# Altium project cSLIM-shield.PrjPcb (part 1 of 2)
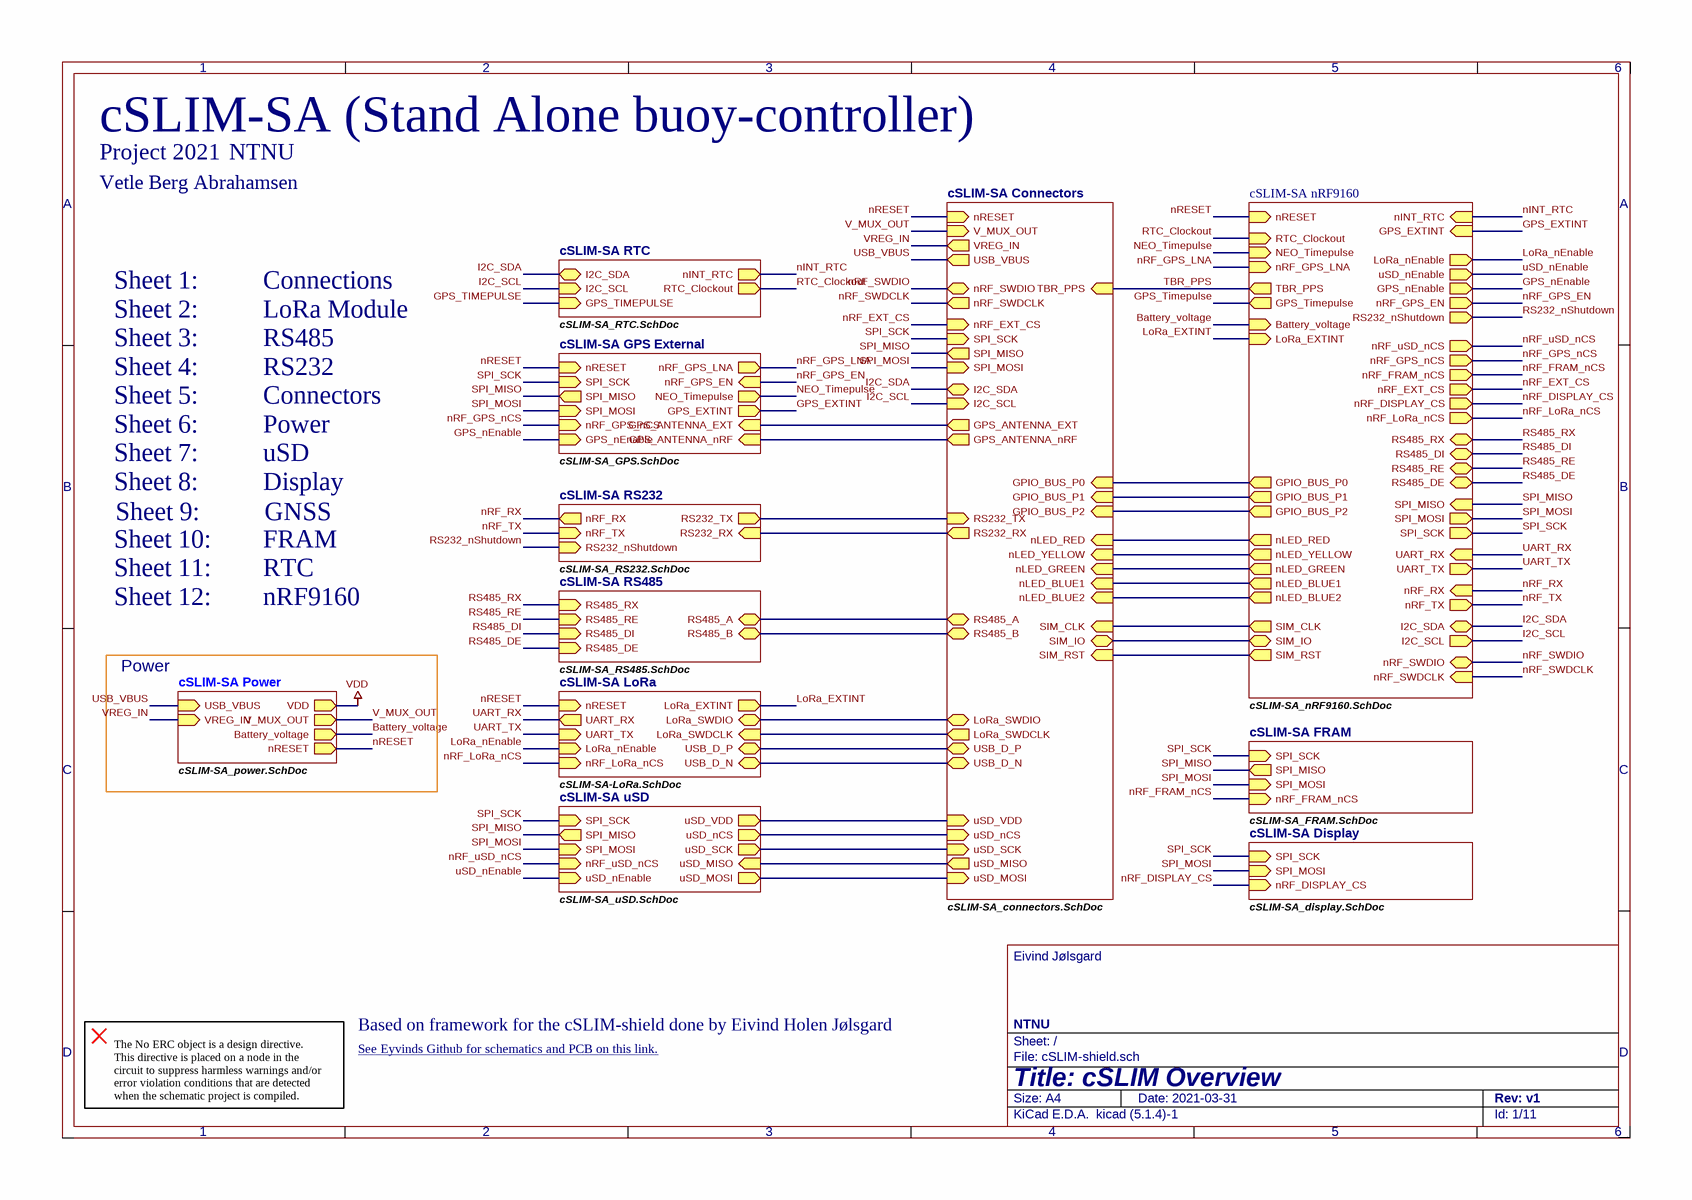
[diagram p0: cSLIM-SA.SchDoc]
12 sheets, 197 parts. Net scope: hierarchical (ports join the sheet entries above them; power ports are global).
Board files: cSLIM_V1.PcbDoc, cSLIM-shield.PcbDoc
Sheets:
  cSLIM-SA.SchDoc
    cSLIM-SA LoRa = cSLIM-SA-LoRa.SchDoc
    cSLIM-SA RS485 = cSLIM-SA_RS485.SchDoc
    cSLIM-SA RS232 = cSLIM-SA_RS232.SchDoc
    cSLIM-SA Connectors = cSLIM-SA_connectors.SchDoc
    cSLIM-SA Power = cSLIM-SA_power.SchDoc
    cSLIM-SA uSD = cSLIM-SA_uSD.SchDoc
    cSLIM-SA Display = cSLIM-SA_display.SchDoc
    cSLIM-SA GPS External = cSLIM-SA_GPS.SchDoc
    cSLIM-SA FRAM = cSLIM-SA_FRAM.SchDoc
    cSLIM-SA RTC = cSLIM-SA_RTC.SchDoc
    cSLIM-SA nRF9160 = cSLIM-SA_nRF9160.SchDoc

## Sheet cSLIM-SA.SchDoc
size 297 x 210 mm; SheetNumber: 1; SheetTotal: 12

### Sub-sheets
cSLIM-SA Connectors = cSLIM-SA_connectors.SchDoc: RS485_A (bidir), RS485_B (bidir), TBR_PPS (in), V_MUX_OUT (in), RS232_TX (in), RS232_RX (out), LoRa_SWDIO (bidir), LoRa_SWDCLK (out), nRESET (in), USB_D_N (bidir), USB_D_P (bidir), USB_VBUS (out), uSD_nCS (in), uSD_MOSI (in), uSD_SCK (in), uSD_MISO (out), uSD_VDD (in), nRF_EXT_CS (in), SPI_SCK (in), SPI_MOSI (in), SPI_MISO (out), I2C_SCL (in), I2C_SDA (bidir), nLED_RED (in), nLED_YELLOW (in), nLED_GREEN (in), nLED_BLUE1 (in), GPS_ANTENNA_EXT (out), nLED_BLUE2 (in), nRF_SWDIO (bidir), nRF_SWDCLK (out), SIM_CLK (in), SIM_RST (in), SIM_IO (bidir), GPS_ANTENNA_nRF (out), VREG_IN (out), GPIO_BUS_P0 (in), GPIO_BUS_P1 (in), GPIO_BUS_P2 (in)
cSLIM-SA Display = cSLIM-SA_display.SchDoc: SPI_SCK (in), SPI_MOSI (in), nRF_DISPLAY_CS (in)
cSLIM-SA FRAM = cSLIM-SA_FRAM.SchDoc: SPI_MISO (out), nRF_FRAM_nCS (in), SPI_SCK (in), SPI_MOSI (in)
cSLIM-SA GPS External = cSLIM-SA_GPS.SchDoc: nRF_GPS_nCS (in), GPS_nEnable (in), SPI_MISO (out), SPI_MOSI (in), SPI_SCK (in), NEO_Timepulse (out), GPS_EXTINT (out), nRESET (in), GPS_ANTENNA_EXT (in), nRF_GPS_EN (in), GPS_ANTENNA_nRF (in), nRF_GPS_LNA (out)
cSLIM-SA LoRa = cSLIM-SA-LoRa.SchDoc: UART_RX (out), UART_TX (in), USB_D_P (bidir), USB_D_N (bidir), LoRa_SWDIO (bidir), LoRa_SWDCLK (in), nRESET (in), LoRa_nEnable (in), LoRa_EXTINT (out), nRF_LoRa_nCS (in)
cSLIM-SA nRF9160 = cSLIM-SA_nRF9160.SchDoc: nRESET (in), RS485_RX (bidir), RS485_DI (bidir), nLED_RED (out), nINT_RTC (in), nLED_GREEN (out), LoRa_nEnable (out), uSD_nEnable (out), nRF_uSD_nCS (out), UART_RX (in), UART_TX (out), nRF_GPS_nCS (out), RS232_nShutdown (out), GPS_nEnable (out), Battery_voltage (in), nRF_EXT_CS (out), I2C_SDA (bidir), I2C_SCL (out), RS485_RE (bidir), RS485_DE (bidir), TBR_PPS (out), SPI_MISO (in), SPI_MOSI (out), SPI_SCK (out), LoRa_EXTINT (in), nRF_RX (in), nRF_TX (out), nRF_FRAM_nCS (out), RTC_Clockout (in), GPS_Timepulse (out), nRF_SWDIO (bidir), nRF_SWDCLK (in), SIM_CLK (out), SIM_IO (bidir), SIM_RST (out), nRF_DISPLAY_CS (out), nLED_YELLOW (out), nLED_BLUE1 (out), nLED_BLUE2 (out), GPS_EXTINT (in), nRF_GPS_EN (out), nRF_GPS_LNA (in), NEO_Timepulse (in), GPIO_BUS_P0 (out), GPIO_BUS_P2 (out), GPIO_BUS_P1 (out), nRF_LoRa_nCS (out)
cSLIM-SA Power = cSLIM-SA_power.SchDoc: nRESET (out), VDD (out), USB_VBUS (in), V_MUX_OUT (out), Battery_voltage (out), VREG_IN (in)
cSLIM-SA RS232 = cSLIM-SA_RS232.SchDoc: RS232_nShutdown (in), RS232_TX (out), RS232_RX (in), nRF_TX (in), nRF_RX (out)
cSLIM-SA RS485 = cSLIM-SA_RS485.SchDoc: RS485_RX (in), RS485_RE (in), RS485_DE (in), RS485_DI (in), RS485_B (bidir), RS485_A (bidir)
cSLIM-SA RTC = cSLIM-SA_RTC.SchDoc: I2C_SCL (in), I2C_SDA (bidir), nINT_RTC (out), RTC_Clockout (out), GPS_TIMEPULSE (in)
cSLIM-SA uSD = cSLIM-SA_uSD.SchDoc: uSD_VDD (out), uSD_MISO (in), uSD_MOSI (out), uSD_SCK (out), uSD_nCS (out), nRF_uSD_nCS (in), uSD_nEnable (in), SPI_MISO (out), SPI_MOSI (in), SPI_SCK (in)

### Nets
Battery_voltage: sheet cSLIM-SA Power/Battery_voltage, sheet cSLIM-SA nRF9160/Battery_voltage
GPIO_BUS_P0: sheet cSLIM-SA Connectors/GPIO_BUS_P0, sheet cSLIM-SA nRF9160/GPIO_BUS_P0
GPIO_BUS_P1: sheet cSLIM-SA Connectors/GPIO_BUS_P1, sheet cSLIM-SA nRF9160/GPIO_BUS_P1
GPIO_BUS_P2: sheet cSLIM-SA Connectors/GPIO_BUS_P2, sheet cSLIM-SA nRF9160/GPIO_BUS_P2
GPS_ANTENNA_EXT: sheet cSLIM-SA Connectors/GPS_ANTENNA_EXT, sheet cSLIM-SA GPS External/GPS_ANTENNA_EXT
GPS_ANTENNA_nRF: sheet cSLIM-SA Connectors/GPS_ANTENNA_nRF, sheet cSLIM-SA GPS External/GPS_ANTENNA_nRF
GPS_EXTINT: sheet cSLIM-SA GPS External/GPS_EXTINT, sheet cSLIM-SA nRF9160/GPS_EXTINT
GPS_nEnable: sheet cSLIM-SA GPS External/GPS_nEnable, sheet cSLIM-SA nRF9160/GPS_nEnable
GPS_TIMEPULSE: sheet cSLIM-SA RTC/GPS_TIMEPULSE, sheet cSLIM-SA nRF9160/GPS_Timepulse
I2C_SCL: sheet cSLIM-SA Connectors/I2C_SCL, sheet cSLIM-SA RTC/I2C_SCL, sheet cSLIM-SA nRF9160/I2C_SCL
I2C_SDA: sheet cSLIM-SA Connectors/I2C_SDA, sheet cSLIM-SA RTC/I2C_SDA, sheet cSLIM-SA nRF9160/I2C_SDA
LoRa_EXTINT: sheet cSLIM-SA LoRa/LoRa_EXTINT, sheet cSLIM-SA nRF9160/LoRa_EXTINT
LoRa_nEnable: sheet cSLIM-SA LoRa/LoRa_nEnable, sheet cSLIM-SA nRF9160/LoRa_nEnable
LoRa_SWDCLK: sheet cSLIM-SA LoRa/LoRa_SWDCLK, sheet cSLIM-SA Connectors/LoRa_SWDCLK
LoRa_SWDIO: sheet cSLIM-SA LoRa/LoRa_SWDIO, sheet cSLIM-SA Connectors/LoRa_SWDIO
NEO_Timepulse: sheet cSLIM-SA GPS External/NEO_Timepulse, sheet cSLIM-SA nRF9160/NEO_Timepulse
nINT_RTC: sheet cSLIM-SA RTC/nINT_RTC, sheet cSLIM-SA nRF9160/nINT_RTC
nLED_BLUE1: sheet cSLIM-SA Connectors/nLED_BLUE1, sheet cSLIM-SA nRF9160/nLED_BLUE1
nLED_BLUE2: sheet cSLIM-SA Connectors/nLED_BLUE2, sheet cSLIM-SA nRF9160/nLED_BLUE2
nLED_GREEN: sheet cSLIM-SA Connectors/nLED_GREEN, sheet cSLIM-SA nRF9160/nLED_GREEN
nLED_RED: sheet cSLIM-SA Connectors/nLED_RED, sheet cSLIM-SA nRF9160/nLED_RED
nLED_YELLOW: sheet cSLIM-SA Connectors/nLED_YELLOW, sheet cSLIM-SA nRF9160/nLED_YELLOW
nRESET: sheet cSLIM-SA LoRa/nRESET, sheet cSLIM-SA Connectors/nRESET, sheet cSLIM-SA Power/nRESET, sheet cSLIM-SA GPS External/nRESET, sheet cSLIM-SA nRF9160/nRESET
nRF_DISPLAY_CS: sheet cSLIM-SA Display/nRF_DISPLAY_CS, sheet cSLIM-SA nRF9160/nRF_DISPLAY_CS
nRF_EXT_CS: sheet cSLIM-SA Connectors/nRF_EXT_CS, sheet cSLIM-SA nRF9160/nRF_EXT_CS
nRF_FRAM_nCS: sheet cSLIM-SA FRAM/nRF_FRAM_nCS, sheet cSLIM-SA nRF9160/nRF_FRAM_nCS
nRF_GPS_EN: sheet cSLIM-SA GPS External/nRF_GPS_EN, sheet cSLIM-SA nRF9160/nRF_GPS_EN
nRF_GPS_LNA: sheet cSLIM-SA GPS External/nRF_GPS_LNA, sheet cSLIM-SA nRF9160/nRF_GPS_LNA
nRF_GPS_nCS: sheet cSLIM-SA GPS External/nRF_GPS_nCS, sheet cSLIM-SA nRF9160/nRF_GPS_nCS
nRF_LoRa_nCS: sheet cSLIM-SA LoRa/nRF_LoRa_nCS, sheet cSLIM-SA nRF9160/nRF_LoRa_nCS
nRF_RX: sheet cSLIM-SA RS232/nRF_RX, sheet cSLIM-SA nRF9160/nRF_RX
nRF_SWDCLK: sheet cSLIM-SA Connectors/nRF_SWDCLK, sheet cSLIM-SA nRF9160/nRF_SWDCLK
nRF_SWDIO: sheet cSLIM-SA Connectors/nRF_SWDIO, sheet cSLIM-SA nRF9160/nRF_SWDIO
nRF_TX: sheet cSLIM-SA RS232/nRF_TX, sheet cSLIM-SA nRF9160/nRF_TX
nRF_uSD_nCS: sheet cSLIM-SA uSD/nRF_uSD_nCS, sheet cSLIM-SA nRF9160/nRF_uSD_nCS
RS232_nShutdown: sheet cSLIM-SA RS232/RS232_nShutdown, sheet cSLIM-SA nRF9160/RS232_nShutdown
RS232_RX: sheet cSLIM-SA RS232/RS232_RX, sheet cSLIM-SA Connectors/RS232_RX
RS232_TX: sheet cSLIM-SA RS232/RS232_TX, sheet cSLIM-SA Connectors/RS232_TX
RS485_A: sheet cSLIM-SA RS485/RS485_A, sheet cSLIM-SA Connectors/RS485_A
RS485_B: sheet cSLIM-SA RS485/RS485_B, sheet cSLIM-SA Connectors/RS485_B
RS485_DE: sheet cSLIM-SA RS485/RS485_DE, sheet cSLIM-SA nRF9160/RS485_DE
RS485_DI: sheet cSLIM-SA RS485/RS485_DI, sheet cSLIM-SA nRF9160/RS485_DI
RS485_RE: sheet cSLIM-SA RS485/RS485_RE, sheet cSLIM-SA nRF9160/RS485_RE
RS485_RX: sheet cSLIM-SA RS485/RS485_RX, sheet cSLIM-SA nRF9160/RS485_RX
RTC_Clockout: sheet cSLIM-SA RTC/RTC_Clockout, sheet cSLIM-SA nRF9160/RTC_Clockout
SIM_CLK: sheet cSLIM-SA Connectors/SIM_CLK, sheet cSLIM-SA nRF9160/SIM_CLK
SIM_IO: sheet cSLIM-SA Connectors/SIM_IO, sheet cSLIM-SA nRF9160/SIM_IO
SIM_RST: sheet cSLIM-SA Connectors/SIM_RST, sheet cSLIM-SA nRF9160/SIM_RST
SPI_MISO: sheet cSLIM-SA Connectors/SPI_MISO, sheet cSLIM-SA uSD/SPI_MISO, sheet cSLIM-SA GPS External/SPI_MISO, sheet cSLIM-SA FRAM/SPI_MISO, sheet cSLIM-SA nRF9160/SPI_MISO
SPI_MOSI: sheet cSLIM-SA Connectors/SPI_MOSI, sheet cSLIM-SA uSD/SPI_MOSI, sheet cSLIM-SA Display/SPI_MOSI, sheet cSLIM-SA GPS External/SPI_MOSI, sheet cSLIM-SA FRAM/SPI_MOSI, sheet cSLIM-SA nRF9160/SPI_MOSI
SPI_SCK: sheet cSLIM-SA Connectors/SPI_SCK, sheet cSLIM-SA uSD/SPI_SCK, sheet cSLIM-SA Display/SPI_SCK, sheet cSLIM-SA GPS External/SPI_SCK, sheet cSLIM-SA FRAM/SPI_SCK, sheet cSLIM-SA nRF9160/SPI_SCK
TBR_PPS: sheet cSLIM-SA Connectors/TBR_PPS, sheet cSLIM-SA nRF9160/TBR_PPS
UART_RX: sheet cSLIM-SA LoRa/UART_RX, sheet cSLIM-SA nRF9160/UART_RX
UART_TX: sheet cSLIM-SA LoRa/UART_TX, sheet cSLIM-SA nRF9160/UART_TX
USB_D_N: sheet cSLIM-SA LoRa/USB_D_N, sheet cSLIM-SA Connectors/USB_D_N
USB_D_P: sheet cSLIM-SA LoRa/USB_D_P, sheet cSLIM-SA Connectors/USB_D_P
USB_VBUS: sheet cSLIM-SA Connectors/USB_VBUS, sheet cSLIM-SA Power/USB_VBUS
uSD_MISO: sheet cSLIM-SA Connectors/uSD_MISO, sheet cSLIM-SA uSD/uSD_MISO
uSD_MOSI: sheet cSLIM-SA Connectors/uSD_MOSI, sheet cSLIM-SA uSD/uSD_MOSI
uSD_nCS: sheet cSLIM-SA Connectors/uSD_nCS, sheet cSLIM-SA uSD/uSD_nCS
uSD_nEnable: sheet cSLIM-SA uSD/uSD_nEnable, sheet cSLIM-SA nRF9160/uSD_nEnable
uSD_SCK: sheet cSLIM-SA Connectors/uSD_SCK, sheet cSLIM-SA uSD/uSD_SCK
uSD_VDD: sheet cSLIM-SA Connectors/uSD_VDD, sheet cSLIM-SA uSD/uSD_VDD
V_MUX_OUT: sheet cSLIM-SA Connectors/V_MUX_OUT, sheet cSLIM-SA Power/V_MUX_OUT
VREG_IN: sheet cSLIM-SA Connectors/VREG_IN, sheet cSLIM-SA Power/VREG_IN

### Notes on the sheet
- cSLIM-SA (Stand Alone buoy-controller)
- Project 2021
- Vetle Berg Abrahamsen
- NTNU
- Sheet 1:          Connections
- Sheet 2:          LoRa Module
- Sheet 3:          RS485
- Sheet 4:          RS232
- Sheet 5:          Connectors
- Sheet 6:          Power
- Sheet 7:          uSD
- Sheet 8:          Display
- Sheet 10:        FRAM
- Sheet 9:          GNSS
- Sheet 11:        RTC
- Sheet 12:        nRF9160
- Power
- Based on framework for the cSLIM-shield done by Eivind Holen Jølsgard
- See Eyvinds Github for schematics and PCB on this link. <https://github.com/eivinhj/cSLIM_nRF9160-DK_shield>
- The No ERC object is a design directive.
  This directive is placed on a node in the circuit to suppress harmless warnings and/or error violation conditions that are detected when the schematic project is compiled.
- 1
- 2
- 3
- 4
- 5
- 6
- A
- B
- C
- Eivind Jølsgard
- D
- Title: cSLIM Overview
- File: cSLIM-shield.sch
- Sheet: /
- KiCad E.D.A.  kicad (5.1.4)-1
- Size: A4
- Date: 2021-03-31
- Rev: v1
- Id: 1/11

## Sheet cSLIM-SA-LoRa.SchDoc
size 297 x 210 mm; SheetNumber: 3; SheetTotal: 12
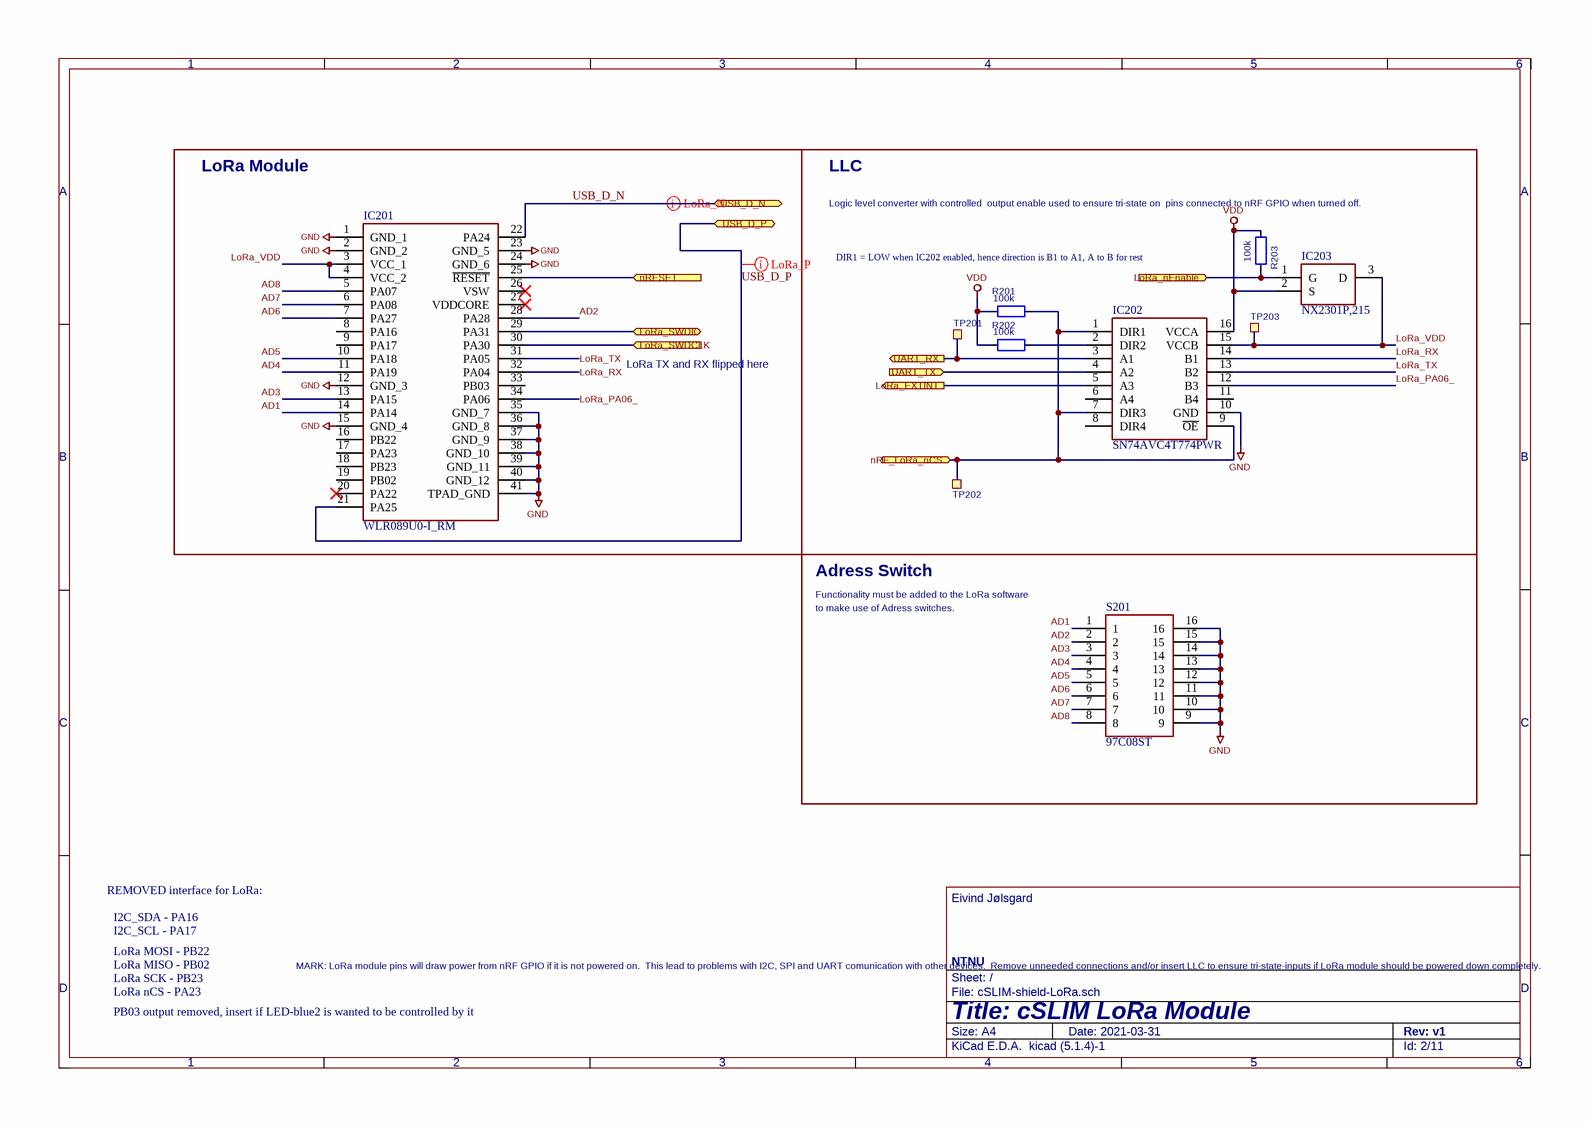
[diagram p1: cSLIM-SA-LoRa.SchDoc]

### Parts
IC201  WLR089U0-I_RM  [WLR089U0IRM]
IC202  SN74AVC4T774PWR  [SOP65P640X120-16N]
IC203  NX2301P,215  [SOT95P230X110-3N]
R201  100k  [RESC1608X55N]
R202  100k  [RESC1608X55N]
R203  100k  [RESC1608X55N]
S201  97C08ST  [SOIC127P671X170-16N]
TP201  (no value)  [TP_SMD_Ø1.0mm]  (no BOM)
TP202  (no value)  [TP_SMD_Ø1.0mm]  (no BOM)
TP203  (no value)  [TP_SMD_Ø1.0mm]  (no BOM)

### Blocks framed on the sheet
Adress Switch: S201

### Ports
LoRa_EXTINT (out), LoRa_nEnable (in), LoRa_SWDCLK (in), LoRa_SWDIO (bidir), nRESET (in), nRF_LoRa_nCS (in), UART_RX (out), UART_TX (in), USB_D_N (bidir), USB_D_P (bidir)

### Nets
GND: IC201.1(GND_1) IC201.2(GND_2) IC201.12(GND_3) IC201.15(GND_4) IC201.23(GND_5) IC201.24(GND_6) IC201.35(GND_7) IC201.36(GND_8) IC201.37(GND_9) IC201.38(GND_10) IC201.39(GND_11) IC201.40(GND_12) IC201.41(TPAD_GND) IC202.10(GND) S201.9 S201.10 S201.11 S201.12 S201.13 S201.14 S201.15 S201.16
VDD: IC202.16(VCCA) IC203.2(S) R201.2 R202.2 R203.2
AD1: IC201.14(PA14) S201.1
AD2: IC201.28(PA28) S201.2
AD3: IC201.13(PA15) S201.3
AD4: IC201.11(PA19) S201.4
AD5: IC201.10(PA18) S201.5
AD6: IC201.7(PA27) S201.6
AD7: IC201.6(PA08) S201.7
AD8: IC201.5(PA07) S201.8
LoRa_EXTINT: IC202.5(A3) ; port LoRa_EXTINT
LoRa_nEnable: IC203.1(G) R203.1 ; port LoRa_nEnable
LoRa_PA06_: IC201.34(PA06) IC202.12(B3)
LoRa_RX: IC201.32(PA04) IC202.14(B1)
LoRa_SWDCLK: IC201.30(PA30) ; port LoRa_SWDCLK
LoRa_SWDIO: IC201.29(PA31) ; port LoRa_SWDIO
LoRa_TX: IC201.31(PA05) IC202.13(B2)
LoRa_VDD: IC201.3(VCC_1) IC201.4(VCC_2) IC202.15(VCCB) IC203.3(D) TP203.1
nRESET: IC201.25(~{RESET}) ; port nRESET
nRF_LoRa_nCS: IC202.1(DIR1) IC202.7(DIR3) IC202.9(~{OE}) R201.1 TP202.1 ; port nRF_LoRa_nCS
UART_RX: IC202.3(A1) TP201.1 ; port UART_RX
UART_TX: IC202.4(A2) ; port UART_TX
USB_D_N: IC201.22(PA24) ; port USB_D_N
USB_D_P: IC201.21(PA25) ; port USB_D_P
NetIC202_2: IC202.2(DIR2) R202.1

Not connected (* = marked no-connect by the designer): IC201 8(PA16) 9(PA17) 16(PB22) 17(PA23) 18(PB23) 19(PB02) 20(PA22)* 26(VSW)* 27(VDDCORE)* 33(PB03); IC202 6(A4) 8(DIR4) 11(B4)

### Layout directives
differential pair: USB_D_N, USB_D_P

### Notes on the sheet
- LoRa Module
- (near R203) Logic level converter with controlled
  output enable used to ensure tri-state
  on  pins connected to nRF GPIO when turned off.
- LLC
- DIR1 = LOW when IC202 enabled, hence direction is B1 to A1, A to B for rest
- LoRa TX and RX flipped here
- Functionality must be added to the LoRa software
- to make use of Adress switches.
- REMOVED interface for LoRa:
- I2C_SDA - PA16
- I2C_SCL - PA17
- LoRa MOSI - PB22
- LoRa MISO - PB02
- LoRa SCK - PB23
- LoRa nCS - PA23
- PB03 output removed, insert if LED-blue2 is wanted to be controlled by it
- MARK: LoRa module pins will draw power from nRF GPIO if it is not powered on.
  This lead to problems with I2C, SPI and UART comunication with other devices.
  Remove unneeded connections and/or insert LLC to ensure tri-state-inputs if
  LoRa module should be powered down completely.
- 1
- 2
- 3
- 4
- 5
- 6
- A
- B
- C
- Eivind Jølsgard
- D
- Title: cSLIM LoRa Module
- File: cSLIM-shield-LoRa.sch
- Sheet: /
- NTNU
- KiCad E.D.A.  kicad (5.1.4)-1
- Size: A4
- Date: 2021-03-31
- Rev: v1
- Id: 2/11

### Library data of the parts
IC201 = WLR089U0-I_RM: Integrated Circuit; Manufacturer_Name: Microchip; Manufacturer_Part_Number: WLR089U0-I/RM; Datasheet Link: https://ww1.microchip.com/downloads/en/DeviceDoc/WLR089U0-Low-Power-LoRa-Sub-GHz-Module-Data-Sheet-DS70005435A.pdf; Height: 2.8mm; Mouser Part Number: 579-WLR089U0-I/RM; Mouser Price/Stock: https://www.mouser.co.uk/ProductDetail/Microchip-Technology/WLR089U0-I-RM?qs=W%2FMpXkg%252BdQ4sfSMsQUYuNg%3D%3D; Arrow Part Number: WLR089U0-I/RM; Arrow Price/Stock: https://www.arrow.com/en/products/wlr089u0-irm/microchip-technology
IC202 = SN74AVC4T774PWR: Integrated Circuit; Manufacturer_Name: Texas Instruments; Datasheet Link: http://www.ti.com/lit/gpn/sn74avc4t774; Height: 1.2mm; Manufacturer_Part_Number: SN74AVC4T774PWR; Mouser Part Number: 595-SN74AVC4T774PWR; Mouser Price/Stock: https://www.mouser.co.uk/ProductDetail/Texas-Instruments/SN74AVC4T774PWR?qs=WxL8HmPi5r562Eu%2F2kE2LA%3D%3D; Arrow Part Number: SN74AVC4T774PWR; Arrow Price/Stock: https://www.arrow.com/en/products/sn74avc4t774pwr/texas-instruments?region=nac
IC203 = NX2301P,215: Integrated Circuit; Manufacturer_Name: Nexperia; Datasheet Link: http://www.nxp.com/documents/data_sheet/NX2301P.pdf; Height: 1.1mm; Manufacturer_Part_Number: NX2301P,215; Mouser Part Number: 771-NX2301P215; Mouser Price/Stock: https://www.mouser.co.uk/ProductDetail/Nexperia/NX2301P215?qs=A1cBxND5mHKs%252BLrxCDENxw%3D%3D; Arrow Part Number: NX2301P,215; Arrow Price/Stock: https://www.arrow.com/en/products/nx2301p215/nexperia
R201-R203 = R: Value: 100k
S201 = 97C08ST: Switch; Manufacturer_Name: Grayhill; Datasheet Link: http://www.grayhill.com/search/?Keywords=97C08ST; Height: 1.7mm; Manufacturer_Part_Number: 97C08ST; Mouser Part Number: 706-97C08ST; Mouser Price/Stock: https://www.mouser.co.uk/ProductDetail/Grayhill/97C08ST?qs=ls7QRyWmRk6QAl4Hs3wGtw%3D%3D; Arrow Part Number: 97C08ST; Arrow Price/Stock: https://www.arrow.com/en/products/97c08st/grayhill
TP201-TP203 = TP

## Sheet cSLIM-SA_RS485.SchDoc: cSLIM v1 - RS485
size A4; SheetNumber: 4; SheetTotal: 12
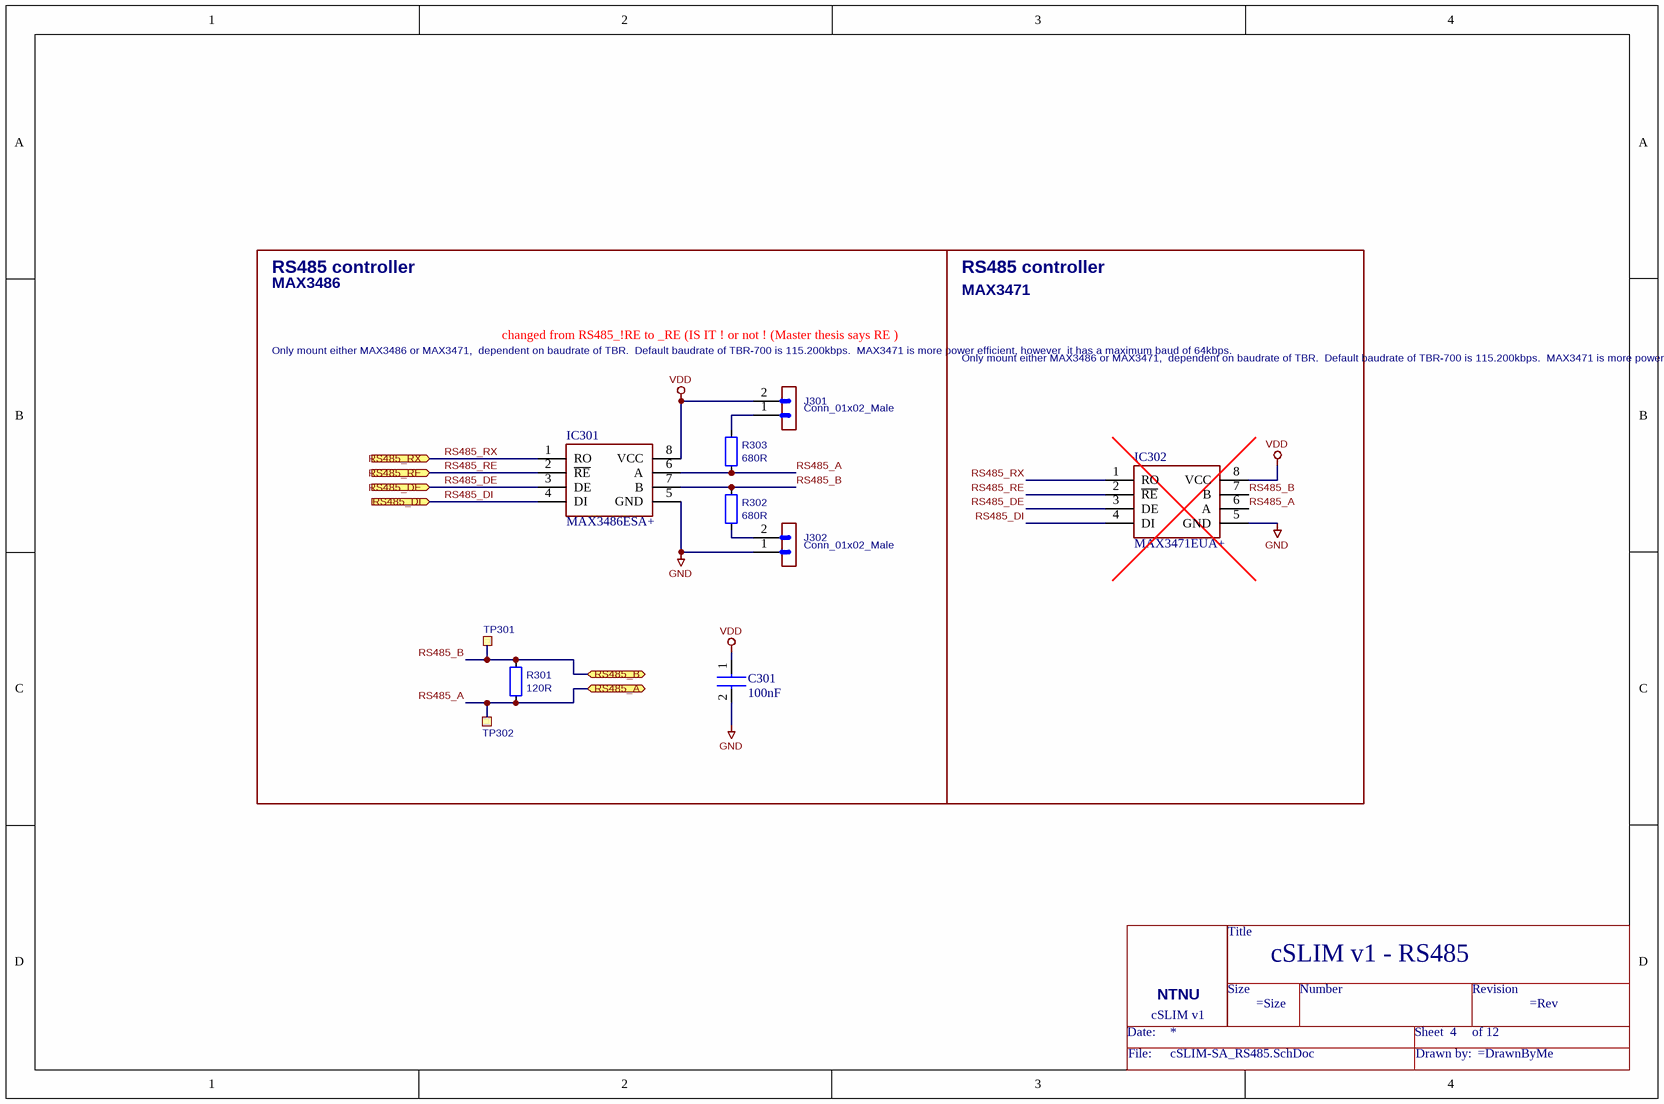
[diagram p2: cSLIM-SA_RS485.SchDoc]

### Parts
(Parts that share a designator on the sheet are numbered #1, #2 ... from top to bottom, then left to right.)
=DocumentName#1  Title_block  (value not drawn)  (no BOM)
C301  100nF  [CAPC1608X90N]
IC301  MAX3486ESA+  [SOIC127P600X175-8N]
IC302  MAX3471EUA+  [SOP65P490X110-8N]
J301  Conn_01x02_Male  [HDRV2W110P0X254_1X2_508X254X854P]
J302  Conn_01x02_Male  [HDRV2W110P0X254_1X2_508X254X854P]
R301  120R  [RESC1608X55N]
R302  680R  [RESC1608X55N]
R303  680R  [RESC1608X55N]
TP301  (no value)  [TP_SMD_Ø1.0mm]  (no BOM)
TP302  (no value)  [TP_SMD_Ø1.0mm]  (no BOM)

### Blocks framed on the sheet
RS485 controller: C301 IC301 J301 J302 R301-R303 TP301 TP302
RS485 controller: IC302

### Ports
RS485_A (bidir), RS485_B (bidir), RS485_DE (in), RS485_DI (in), RS485_RE (in), RS485_RX (in)

### Nets
GND: C301.2 IC301.5(GND) IC302.5(GND) J302.1
VDD: C301.1 IC301.8(VCC) IC302.8(VCC) J301.2
RS485_A: IC301.6(A) IC302.6(A) R301.2 R303.2 TP302.1 ; port RS485_A
RS485_B: IC301.7(B) IC302.7(B) R301.1 R302.1 TP301.1 ; port RS485_B
RS485_DE: IC301.3(DE) IC302.3(DE) ; port RS485_DE
RS485_DI: IC301.4(DI) IC302.4(DI) ; port RS485_DI
RS485_RE: IC301.2(~{RE}) IC302.2(~{RE}) ; port RS485_RE
RS485_RX: IC301.1(RO) IC302.1(RO) ; port RS485_RX
NetJ301_1: J301.1 R303.1
NetJ302_2: J302.2 R302.2

### Notes on the sheet
- MAX3486
- MAX3471
- (near J301) Only mount either MAX3486 or MAX3471,
  dependent on baudrate of TBR.
  Default baudrate of TBR-700 is 115.200kbps.
  MAX3471 is more power efficient, however
  it has a maximum baud of 64kbps.
- changed from RS485_!RE to _RE (IS IT ! or not ! (Master thesis says RE )
- Only mount either MAX3486 or MAX3471,
  dependent on baudrate of TBR.
  Default baudrate of TBR-700 is 115.200kbps.
  MAX3471 is more power efficient, however
  it has a maximum baud of 64kbps.
- 1
- 2
- 3
- 4
- 5
- 6
- A
- B
- C
- Eivind Jølsgard
- D
- Title: cSLIM RS485
- File: cSLIM_RS485.sch
- Sheet: /
- NTNU
- KiCad E.D.A.  kicad (5.1.4)-1
- Size: A4
- Date: 2021-06-30
- Rev: v1.1
- Id: 3/11
- (in symbol Title_block) Title; Size; Number; Revision; NTNU; cSLIM v1; Date:; Sheet; of; File:; Drawn by:

### Library data of the parts
C301 = C: Capacitor; Manufacturer_Name: AVX; Manufacturer_Part_Number: 06033G104ZAT2A; Datasheet Link: http://www.mouser.com/catalog/supplier/library/pdf/AVXSurfaceMountCeramic.pdf; Height: 0.9mm; Mouser Part Number: 581-06033G104Z; Mouser Price/Stock: https://www.mouser.co.uk/ProductDetail/AVX/06033G104ZAT2A?qs=NXubJDmysXJMPmHfVo6Z%252BA%3D%3D; Arrow Part Number: 06033G104ZAT2A; Arrow Price/Stock: https://www.arrow.com/en/products/06033g104zat2a/avx?region=nac
IC301 = MAX3486ESA+: Integrated Circuit; Manufacturer_Name: Maxim Integrated; Datasheet Link: http://datasheets.maximintegrated.com/en/ds/MAX3483-MAX3491.pdf; Height: 1.75mm; Manufacturer_Part_Number: MAX3486ESA+; Mouser Part Number: 700-MAX3486ESA; Mouser Price/Stock: https://www.mouser.co.uk/ProductDetail/Maxim-Integrated/MAX3486ESA%2b?qs=1THa7WoU59FIrgcgBLF9fg%3D%3D
IC302 = MAX3471EUA+: Integrated Circuit; Manufacturer_Name: Maxim Integrated; Datasheet Link: http://docs-emea.rs-online.com/webdocs/0f71/0900766b80f719c9.pdf; Height: 1.1mm; Manufacturer_Part_Number: MAX3471EUA+; Mouser Part Number: 700-MAX3471EUA; Mouser Price/Stock: https://www.mouser.co.uk/ProductDetail/Maxim-Integrated/MAX3471EUA%2b?qs=1THa7WoU59GPWTW%252BBV1kJA%3D%3D
J301 J302 = 61300211121: Connector; Manufacturer_Name: Wurth Elektronik; Datasheet Link: https://componentsearchengine.com/Datasheets/2/61300211121.pdf; Height: 8.54mm; Manufacturer_Part_Number: 61300211121; Mouser Part Number: 710-61300211121; Mouser Price/Stock: https://www.mouser.co.uk/ProductDetail/Wurth-Elektronik/61300211121?qs=t4813l51qx%252B1A5GYDQxPlw%3D%3D
R301-R303 = R
  R301: Value: 120R
  R302 R303: Value: 680R
TP301 TP302 = TP

## Sheet cSLIM-SA_RS232.SchDoc
size 297 x 210 mm; SheetNumber: 5
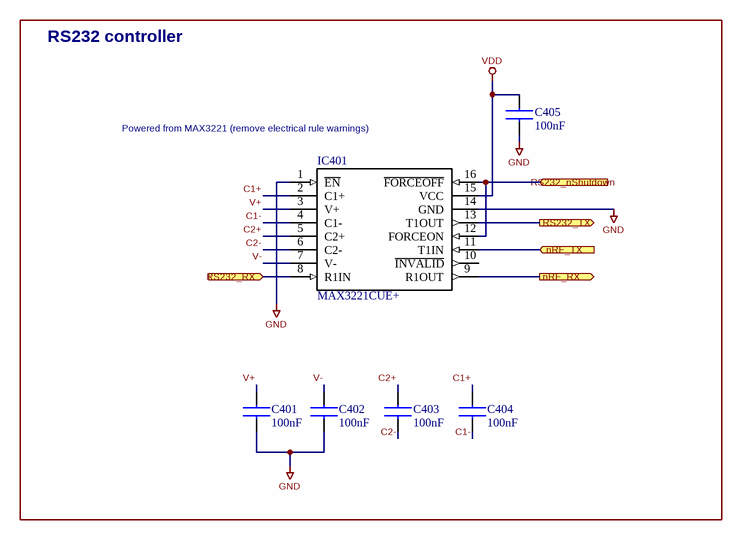
[diagram p3: cSLIM-SA_RS232.SchDoc]

### Parts
C401  100nF  [CAPC1608X90N]
C402  100nF  [CAPC1608X90N]
C403  100nF  [CAPC1608X90N]
C404  100nF  [CAPC1608X90N]
C405  100nF  [CAPC1608X90N]
IC401  MAX3221CUE+  [SOP65P640X110-16N]

### Ports
nRF_RX (out), nRF_TX (in), RS232_nShutdown (in), RS232_RX (in), RS232_TX (out)

### Nets
GND: C401.2 C402.2 C405.2 IC401.1(~{EN}) IC401.14(GND)
VDD: C405.1 IC401.15(VCC)
C1+: C404.1 IC401.2(C1+)
C1-: C404.2 IC401.4(C1-)
C2+: C403.1 IC401.5(C2+)
C2-: C403.2 IC401.6(C2-)
nRF_RX: IC401.9(R1OUT) ; port nRF_RX
nRF_TX: IC401.11(T1IN) ; port nRF_TX
RS232_nShutdown: IC401.12(FORCEON) IC401.16(~{FORCEOFF}) ; port RS232_nShutdown
RS232_RX: IC401.8(R1IN) ; port RS232_RX
RS232_TX: IC401.13(T1OUT) ; port RS232_TX
V+: C401.1 IC401.3(V+)
V-: C402.1 IC401.7(V-)

Not connected (* = marked no-connect by the designer): IC401 10(~{INVALID})

### Notes on the sheet
- RS232 controller
- (near IC401) Powered from MAX3221
  (remove electrical rule warnings)
- 1
- 2
- 3
- 4
- 5
- 6
- A
- B
- C
- Eivind Jølsgard
- D
- Title: cSLIM RS232
- File: cSLIM_RS232.sch
- Sheet: /
- NTNU
- KiCad E.D.A.  kicad (5.1.4)-1
- Size: A4
- Date: 2021-03-31
- Rev: v1
- Id: 4/11

### Library data of the parts
C401-C405 = C: as C301 on sheet cSLIM-SA_RS485; Datasheet Link: http://www.mouser.com/catalog/supplier/library/pdf/AVXSurfaceMountCeramic.pdf; Height: 0.9mm; Mouser Part Number: 581-06033G104Z; Mouser Price/Stock: https://www.mouser.co.uk/ProductDetail/AVX/06033G104ZAT2A?qs=NXubJDmysXJMPmHfVo6Z%252BA%3D%3D; Arrow Part Number: 06033G104ZAT2A; Arrow Price/Stock: https://www.arrow.com/en/products/06033g104zat2a/avx?region=nac
IC401 = MAX3221CUE+: Integrated Circuit; Manufacturer_Name: Maxim Integrated; Datasheet Link: http://datasheets.maximintegrated.com/en/ds/MAX3221-MAX3243.pdf; Height: 1.1mm; Manufacturer_Part_Number: MAX3221CUE+; Mouser Part Number: 700-MAX3221CUE; Mouser Price/Stock: https://www.mouser.co.uk/ProductDetail/Maxim-Integrated/MAX3221CUE%2b?qs=1THa7WoU59EZwCeWs5OtSQ%3D%3D

## Sheet cSLIM-SA_connectors.SchDoc
size 297 x 210 mm; SheetNumber: 6
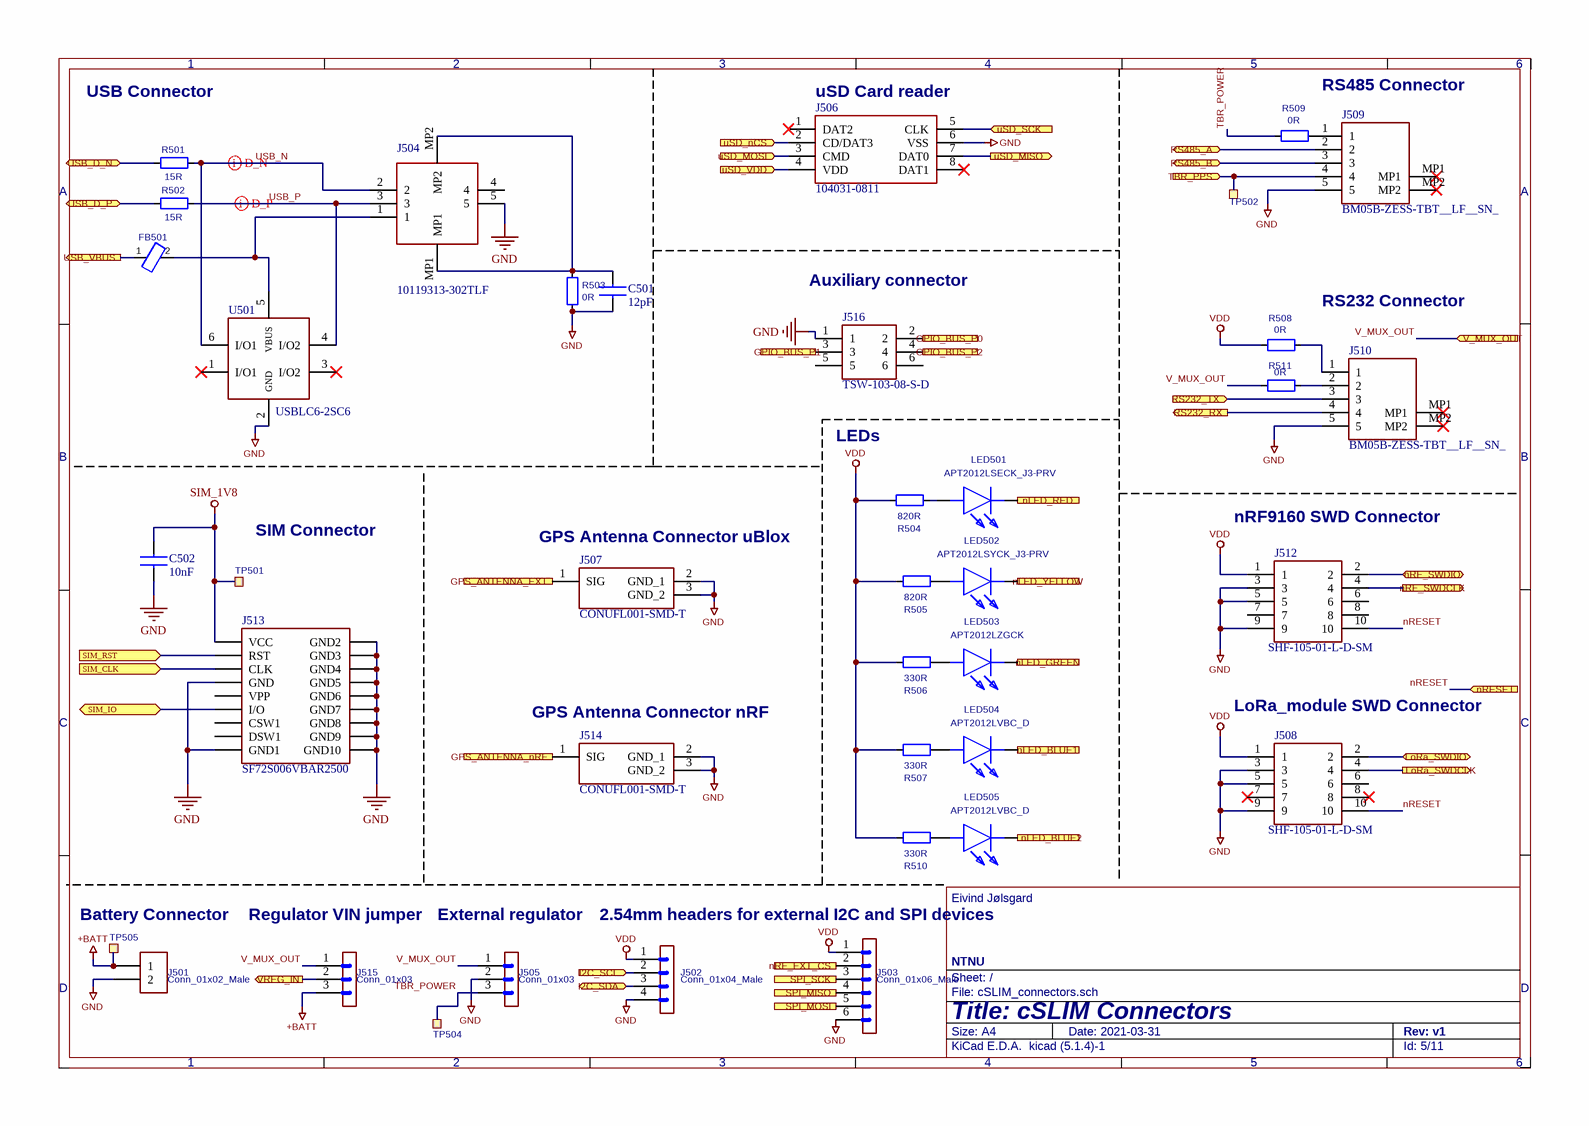
[diagram p4: cSLIM-SA_connectors.SchDoc]

### Parts
C501  12pF  [CAPC1608X90N]
C502  10nF  [CAPC1608X90N]
FB501  500mA  [CAPC1608X90N]  (value not drawn)
J501  Conn_01x02_Male  [SHDR2W64P0X254_1X2_737X660X1181P]
J502  Conn_01x04_Male  [HDRV4W64P0X254_1X4_1016X250X901P]
J503  Conn_01x06_Male  [HDRV6W64P0X254_1X6_1524X254X869P]
J504  10119313-302TLF  [10119313302TLF]
J505  Conn_01x03  [HDRV3W64P0X254_1X3_762X254X869P]
J506  104031-0811  [1040310811]
J507  CONUFL001-SMD-T  [CONUFL001-SMD]
J508  SHF-105-01-L-D-SM  [SHF10501LDSMLCKTR]
J509  BM05B-ZESS-TBT__LF__SN_  [BM05BZESSTBTLFSN]
J510  BM05B-ZESS-TBT__LF__SN_  [BM05BZESSTBTLFSN]
J512  SHF-105-01-L-D-SM  [SHF10501LDSMLCKTR]
J513  SF72S006VBAR2500  [SF72S006VBAR2500]
J514  CONUFL001-SMD-T  [CONUFL001-SMD]
J515  Conn_01x03  [HDRV3W64P0X254_1X3_762X254X869P]
J516  TSW-103-08-S-D  [HDRV6W64P254_2X3_762X495X838P]
LED501  APT2012LSECK_J3-PRV  [LEDC2012X75N]
LED502  APT2012LSYCK_J3-PRV  [LEDC2012X85N]
LED503  APT2012LZGCK  [LEDC2012X85N]
LED504  APT2012LVBC_D  [LEDC2012X85N]
LED505  APT2012LVBC_D  [LEDC2012X85N]
R501  15R  [RESC1608X55N]
R502  15R  [RESC1608X55N]
R503  0R  [RESC1608X55N]
R504  820R  [RESC1608X55N]
R505  820R  [RESC1608X55N]
R506  330R  [RESC1608X55N]
R507  330R  [RESC1608X55N]
R508  0R  [RESC1608X55N]
R509  0R  [RESC1608X55N]
R510  330R  [RESC1608X55N]
R511  0R  [RESC1608X55N]
TP501  (no value)  [TP_SMD_Ø1.0mm]  (no BOM)
TP502  (no value)  [TP_SMD_Ø1.0mm]  (no BOM)
TP504  (no value)  [TP_SMD_Ø1.0mm]  (no BOM)
TP505  (no value)  [TP_SMD_Ø1.0mm]  (no BOM)
U501  USBLC6-2SC6  [SOT95P280X145-6N]

### Ports
GPIO_BUS_P0 (in), GPIO_BUS_P1 (in), GPIO_BUS_P2 (in), GPS_ANTENNA_EXT (out), GPS_ANTENNA_nRF (out), I2C_SCL (in), I2C_SDA (bidir), LoRa_SWDCLK (out), LoRa_SWDIO (bidir), nLED_BLUE1 (in), nLED_BLUE2 (in), nLED_GREEN (in), nLED_RED (in), nLED_YELLOW (in), nRESET (in), nRF_EXT_CS (in), nRF_SWDCLK (out), nRF_SWDIO (bidir), RS232_RX (out), RS232_TX (in), RS485_A (bidir), RS485_B (bidir), SIM_CLK (in), SIM_IO (bidir), SIM_RST (in), SPI_MISO (out), SPI_MOSI (in), SPI_SCK (in), TBR_PPS (in), USB_D_N (bidir), USB_D_P (bidir), USB_VBUS (out), uSD_MISO (out), uSD_MOSI (in), uSD_nCS (in), uSD_SCK (in), uSD_VDD (in), V_MUX_OUT (in), VREG_IN (out)

### Nets
+BATT: J501.1 J515.3 TP505.1
GND: C501.2 C502.2 J501.2 J502.4 J503.6 J504.5 J505.2 J506.6(VSS) J507.2(GND_1) J507.3(GND_2) J508.3 J508.5 J508.9 J509.5 J510.5 J512.3 J512.5 J512.9 J513.C5(GND) J513.GND1 J513.GND2 J513.GND3 J513.GND4 J513.GND5 J513.GND6 J513.GND7 J513.GND8 J513.GND9 J513.GND10 J514.2(GND_1) J514.3(GND_2) J516.1 R503.2 U501.2(GND)
SIM_1V8: C502.1 J513.C1(VCC) TP501.1
VDD: J502.1 J503.1 J508.1 J512.1 R504.2 R505.2 R506.2 R507.2 R508.2 R510.2
GPIO_BUS_P0: J516.2 ; port GPIO_BUS_P0
GPIO_BUS_P1: J516.3 ; port GPIO_BUS_P1
GPIO_BUS_P2: J516.4 ; port GPIO_BUS_P2
GPS_ANTENNA_EXT: J507.1(SIG) ; port GPS_ANTENNA_EXT
GPS_ANTENNA_nRF: J514.1(SIG) ; port GPS_ANTENNA_nRF
I2C_SCL: J502.2 ; port I2C_SCL
I2C_SDA: J502.3 ; port I2C_SDA
LoRa_SWDCLK: J508.4 ; port LoRa_SWDCLK
LoRa_SWDIO: J508.2 ; port LoRa_SWDIO
nLED_BLUE1: LED504.1(K) ; port nLED_BLUE1
nLED_BLUE2: LED505.1(K) ; port nLED_BLUE2
nLED_GREEN: LED503.1(K) ; port nLED_GREEN
nLED_RED: LED501.1(K) ; port nLED_RED
nLED_YELLOW: LED502.1(K) ; port nLED_YELLOW
nRESET: J508.10 J512.10 ; port nRESET
nRF_EXT_CS: J503.2 ; port nRF_EXT_CS
nRF_SWDCLK: J512.4 ; port nRF_SWDCLK
nRF_SWDIO: J512.2 ; port nRF_SWDIO
RS232_RX: J510.4 ; port RS232_RX
RS232_TX: J510.3 ; port RS232_TX
RS485_A: J509.2 ; port RS485_A
RS485_B: J509.3 ; port RS485_B
SIM_CLK: J513.C3(CLK) ; port SIM_CLK
SIM_IO: J513.C7(I/O) ; port SIM_IO
SIM_RST: J513.C2(RST) ; port SIM_RST
SPI_MISO: J503.4 ; port SPI_MISO
SPI_MOSI: J503.5 ; port SPI_MOSI
SPI_SCK: J503.3 ; port SPI_SCK
TBR_POWER: J505.3 R509.2 TP504.1
TBR_PPS: J509.4 TP502.1 ; port TBR_PPS
USB_D_N: R501.2 ; port USB_D_N
USB_D_P: R502.2 ; port USB_D_P
USB_N: J504.2 R501.1 U501.6(I/O1)
USB_P: J504.3 R502.1 U501.4(I/O2)
USB_VBUS: FB501.1 ; port USB_VBUS
uSD_MISO: J506.7(DAT0) ; port uSD_MISO
uSD_MOSI: J506.3(CMD) ; port uSD_MOSI
uSD_nCS: J506.2(CD/DAT3) ; port uSD_nCS
uSD_SCK: J506.5(CLK) ; port uSD_SCK
uSD_VDD: J506.4(VDD) ; port uSD_VDD
V_MUX_OUT: J505.1 J515.1 R511.2 ; port V_MUX_OUT
VREG_IN: J515.2 ; port VREG_IN
NetC501_1: C501.1 J504.MP1 J504.MP2 R503.1
NetFB501_2: FB501.2 J504.1 U501.5(VBUS)
NetJ509_1: J509.1 R509.1
NetJ510_1: J510.1 R508.1
NetJ510_2: J510.2 R511.1
NetLED501_2: LED501.2(A) R504.1
NetLED502_2: LED502.2(A) R505.1
NetLED503_2: LED503.2(A) R506.1
NetLED504_2: LED504.2(A) R507.1
NetLED505_2: LED505.2(A) R510.1

Not connected (* = marked no-connect by the designer): J504 4; J506 1(DAT2)* 8(DAT1)*; J508 6 7* 8*; J509 MP1* MP2*; J510 MP1* MP2*; J512 6 7 8; J513 C6(VPP) CSW1 DSW1; J516 5 6; U501 1(I/O1)* 3(I/O2)*

### Layout directives
differential pair: USB_N, USB_P

### Notes on the sheet
- USB Connector
- (near J506) uSD Card reader
- RS485 Connector
- (near J516) Auxiliary connector
- RS232 Connector
- LEDs
- (near TP501) SIM Connector
- (near J512) nRF9160 SWD Connector
- (near J507) GPS Antenna Connector uBlox
- (near J514) GPS Antenna Connector nRF
- (near J508) LoRa_module SWD Connector
- Battery Connector
- (near J515) Regulator VIN jumper
- (near J505) External regulator
- 2.54mm headers for external I2C and SPI devices
- 1
- 2
- 3
- 4
- 5
- 6
- A
- B
- C
- Eivind Jølsgard
- D
- Title: cSLIM Connectors
- File: cSLIM_connectors.sch
- Sheet: /
- NTNU
- KiCad E.D.A.  kicad (5.1.4)-1
- Size: A4
- Date: 2021-03-31
- Rev: v1
- Id: 5/11

### Library data of the parts
C501 C502 = C: as C301 on sheet cSLIM-SA_RS485; Datasheet Link: http://www.mouser.com/catalog/supplier/library/pdf/AVXSurfaceMountCeramic.pdf; Height: 0.9mm; Mouser Part Number: 581-06033G104Z; Mouser Price/Stock: https://www.mouser.co.uk/ProductDetail/AVX/06033G104ZAT2A?qs=NXubJDmysXJMPmHfVo6Z%252BA%3D%3D; Arrow Part Number: 06033G104ZAT2A; Arrow Price/Stock: https://www.arrow.com/en/products/06033g104zat2a/avx?region=nac
FB501 = Ferrite_Bead
J501 = 70543-0001: Connector; Manufacturer_Name: Molex; Datasheet Link: http://www.molex.com/pdm_docs/sd/705430001_sd.pdf; Height: 11.81mm; Manufacturer_Part_Number: 70543-0001; Mouser Part Number: 538-70543-0001; Mouser Price/Stock: https://www.mouser.co.uk/ProductDetail/Molex/70543-0001?qs=tYx%252BZc2nXqpCsE0XoulATg%3D%3D
J502 = PH1-04-UA: Connector; Manufacturer_Name: Adam Tech; Datasheet Link: https://datasheet.datasheetarchive.com/originals/distributors/Datasheets_SAMA/22522227e000bb8d8f26a3580c1bb98b.pdf; Height: 9.008mm; Manufacturer_Part_Number: PH1-04-UA; Arrow Part Number: PH1-04-UA; Arrow Price/Stock: https://www.arrow.com/en/products/ph1-04-ua/adam-tech
J503 = 61300611121: Connector; Manufacturer_Name: Wurth Elektronik; Datasheet Link: https://componentsearchengine.com/Datasheets/2/61300611121.pdf; Height: 8.69mm; Manufacturer_Part_Number: 61300611121; Mouser Part Number: 710-61300611121; Mouser Price/Stock: https://www.mouser.co.uk/ProductDetail/Wurth-Elektronik/61300611121?qs=t4813l51qx%2FRpdf0Kp1HlQ%3D%3D
J504 = 10119313-302TLF: Connector; Manufacturer_Name: Amphenol; Datasheet Link: https://www.arrow.com/en/products/10119313-302tlf/amphenol-fci; Height: 9.55mm; Manufacturer_Part_Number: 10119313-302TLF; Mouser Part Number: 649-10119313-302TLF; Mouser Price/Stock: https://www.mouser.co.uk/ProductDetail/Amphenol-FCI/10119313-302TLF?qs=QcFhgjUTvvpTzLjwlVEXAA%3D%3D; Arrow Part Number: 10119313-302TLF; Arrow Price/Stock: https://www.arrow.com/en/products/10119313-302tlf/amphenol-fci
J505 J515 = 61300311121: Connector; Manufacturer_Name: Wurth Elektronik; Datasheet Link: http://katalog.we-online.de/em/datasheet/6130xx11121.pdf; Height: 8.69mm; Manufacturer_Part_Number: 61300311121; Mouser Part Number: 710-61300311121; Mouser Price/Stock: https://www.mouser.co.uk/ProductDetail/Wurth-Elektronik/61300311121?qs=PhR8RmCirEYxRWFJzNKsUw%3D%3D
J506 = 104031-0811: Connector; Manufacturer_Name: Molex; Datasheet Link: http://www.molex.com/webdocs/datasheets/pdf/en-us/1040310811_MEMORY_CARD_SOCKET.pdf; Manufacturer_Part_Number: 104031-0811; Mouser Part Number: 538-104031-0811; Mouser Price/Stock: https://www.mouser.co.uk/ProductDetail/Molex/104031-0811?qs=udsGRKD4nA3Tvy7wqky%252BuA%3D%3D
J507 J514 = CONUFL001-SMD-T: Connector; Manufacturer_Name: Linx Technologies; Datasheet Link: https://linxtechnologies.com/wp/product/mhf-rf-connectors/; Manufacturer_Part_Number: CONUFL001-SMD-T; Mouser Part Number: 712-CONUFL001-SMD-T; Mouser Price/Stock: https://www.mouser.co.uk/ProductDetail/Linx-Technologies/CONUFL001-SMD-T?qs=EU6FO9ffTwfRdkBeQTdJWQ%3D%3D
J508 J512 = SHF-105-01-L-D-SM-LC-K-TR: Connector; Manufacturer_Name: Samtech; Datasheet Link: https://suddendocs.samtec.com/prints/shf-1xx-01-x-d-xx-xx-xx-mkt.pdf; Height: 5.33mm; Manufacturer_Part_Number: SHF-105-01-L-D-SM-LC-K-TR
J509 J510 = BM05B-ZESS-TBT__LF__SN_: Connector; Manufacturer_Name: JST (JAPAN SOLDERLESS TERMINALS); Manufacturer_Part_Number: BM05B-ZESS-TBT (LF)(SN); Datasheet Link: https://www.arrow.com/en/products/bm05b-zess-tbt-lf-sn/jst-manufacturing; Height: 7.5mm; Arrow Part Number: BM05B-ZESS-TBT (LF)(SN); Arrow Price/Stock: https://www.arrow.com/en/products/bm05b-zess-tbt-lf-sn/jst-manufacturing
J513 = SF72S006VBAR2500: Connector; Manufacturer_Name: JAE Electronics; Datasheet Link: https://componentsearchengine.com/Datasheets/1/SF72S006VBAR2500.pdf; Height: 1.25mm; Manufacturer_Part_Number: SF72S006VBAR2500; Mouser Part Number: 656-SF72S006VBAR2500; Mouser Price/Stock: https://www.mouser.co.uk/ProductDetail/JAE-Electronics/SF72S006VBAR2500?qs=zwT864VV%2FINpxlkc4yTPCw%3D%3D
J516 = TSW-103-08-S-D: Connector; Manufacturer_Name: SAMTEC; Datasheet Link: http://suddendocs.samtec.com/catalog_english/tsw_th.pdf; Height: 8.38mm; Manufacturer_Part_Number: TSW-103-08-S-D; Mouser Part Number: 200-TSW10308SD; Mouser Price/Stock: https://www.mouser.co.uk/ProductDetail/Samtec/TSW-103-08-S-D?qs=rU5fayqh%252BE0V5%2FEE8QdeZQ%3D%3D; Arrow Part Number: TSW-103-08-S-D; Arrow Price/Stock: https://www.arrow.com/en/products/tsw-103-08-s-d/samtec
LED501 = APT2012LSECK_J3-PRV: LED; Manufacturer_Name: Kingbright; Manufacturer_Part_Number: APT2012LSECK/J3-PRV; Datasheet Link: http://www.kingbrightusa.com/images/catalog/SPEC/APT2012LSECK-J3-PRV.pdf; Height: 0.75mm; Mouser Part Number: 604-APT2012LSECKJ3RV; Mouser Price/Stock: https://www.mouser.co.uk/ProductDetail/Kingbright/APT2012LSECK-J3-PRV?qs=6oMev5NRZMEkGJkKIsAalQ%3D%3D; Arrow Part Number: APT2012LSECK/J3-PRV; Arrow Price/Stock: https://www.arrow.com/en/products/apt2012lseckj3-prv/kingbright
LED502 = APT2012LSYCK_J3-PRV: LED; Manufacturer_Name: Kingbright; Manufacturer_Part_Number: APT2012LSYCK/J3-PRV; Datasheet Link: http://www.kingbrightusa.com/images/catalog/SPEC/APT2012LSYCK-J3-PRV.pdf; Height: 0.85mm; Mouser Part Number: 604-APT2012LSYCKJ3RV; Mouser Price/Stock: https://www.mouser.co.uk/ProductDetail/Kingbright/APT2012LSYCK-J3-PRV?qs=6oMev5NRZMGoWLCc4feqUg%3D%3D; Arrow Part Number: APT2012LSYCK/J3-PRV; Arrow Price/Stock: https://www.arrow.com/en/products/apt2012lsyckj3-prv/kingbright
LED503 = APT2012LZGCK: LED; Manufacturer_Name: Kingbright; Datasheet Link: http://www.kingbrightusa.com/images/catalog/SPEC/APT2012LZGCK.pdf; Height: 0.85mm; Manufacturer_Part_Number: APT2012LZGCK; Mouser Part Number: 604-APT2012LZGCK; Mouser Price/Stock: https://www.mouser.co.uk/ProductDetail/Kingbright/APT2012LZGCK?qs=6oMev5NRZMHOosFiXb%2F3qw%3D%3D; Arrow Part Number: APT2012LZGCK; Arrow Price/Stock: https://www.arrow.com/en/products/apt2012lzgck/kingbright
LED504 LED505 = APT2012LVBC_D: LED; Manufacturer_Name: Kingbright; Manufacturer_Part_Number: APT2012LVBC/D; Datasheet Link: https://componentsearchengine.com/Datasheets/1/APT2012LVBC_D.pdf; Height: 0.85mm; Mouser Part Number: 604-APT2012LVBCD; Mouser Price/Stock: https://www.mouser.co.uk/ProductDetail/Kingbright/APT2012LVBC-D?qs=6oMev5NRZMGErJYT6KZLXg%3D%3D; Arrow Part Number: APT2012LVBC/D; Arrow Price/Stock: https://www.arrow.com/en/products/apt2012lvbcd/kingbright
R501-R511 = R
  R501 R502: Value: 15R
  R503 R508 R509 R511: Value: 0R
  R504 R505: Value: 820R
  R506 R507 R510: Value: 330R
TP501 TP502 TP504 TP505 = TP
U501 = USBLC6-2SC6: Integrated Circuit; Manufacturer_Name: STMicroelectronics; Datasheet Link: http://www.st.com/st-web-ui/static/active/en/resource/technical/document/datasheet/CD00050750.pdf; Height: 1.45mm; Manufacturer_Part_Number: USBLC6-2SC6; Mouser Part Number: 511-USBLC6-2SC6; Mouser Price/Stock: https://www.mouser.co.uk/ProductDetail/STMicroelectronics/USBLC6-2SC6?qs=po45yt2pPpu%2FhNIlwQdTlg%3D%3D; Arrow Part Number: USBLC6-2SC6; Arrow Price/Stock: https://www.arrow.com/en/products/usblc6-2sc6/stmicroelectronics?region=nac

## Sheet cSLIM-SA_power.SchDoc
size 297 x 210 mm; SheetNumber: 7
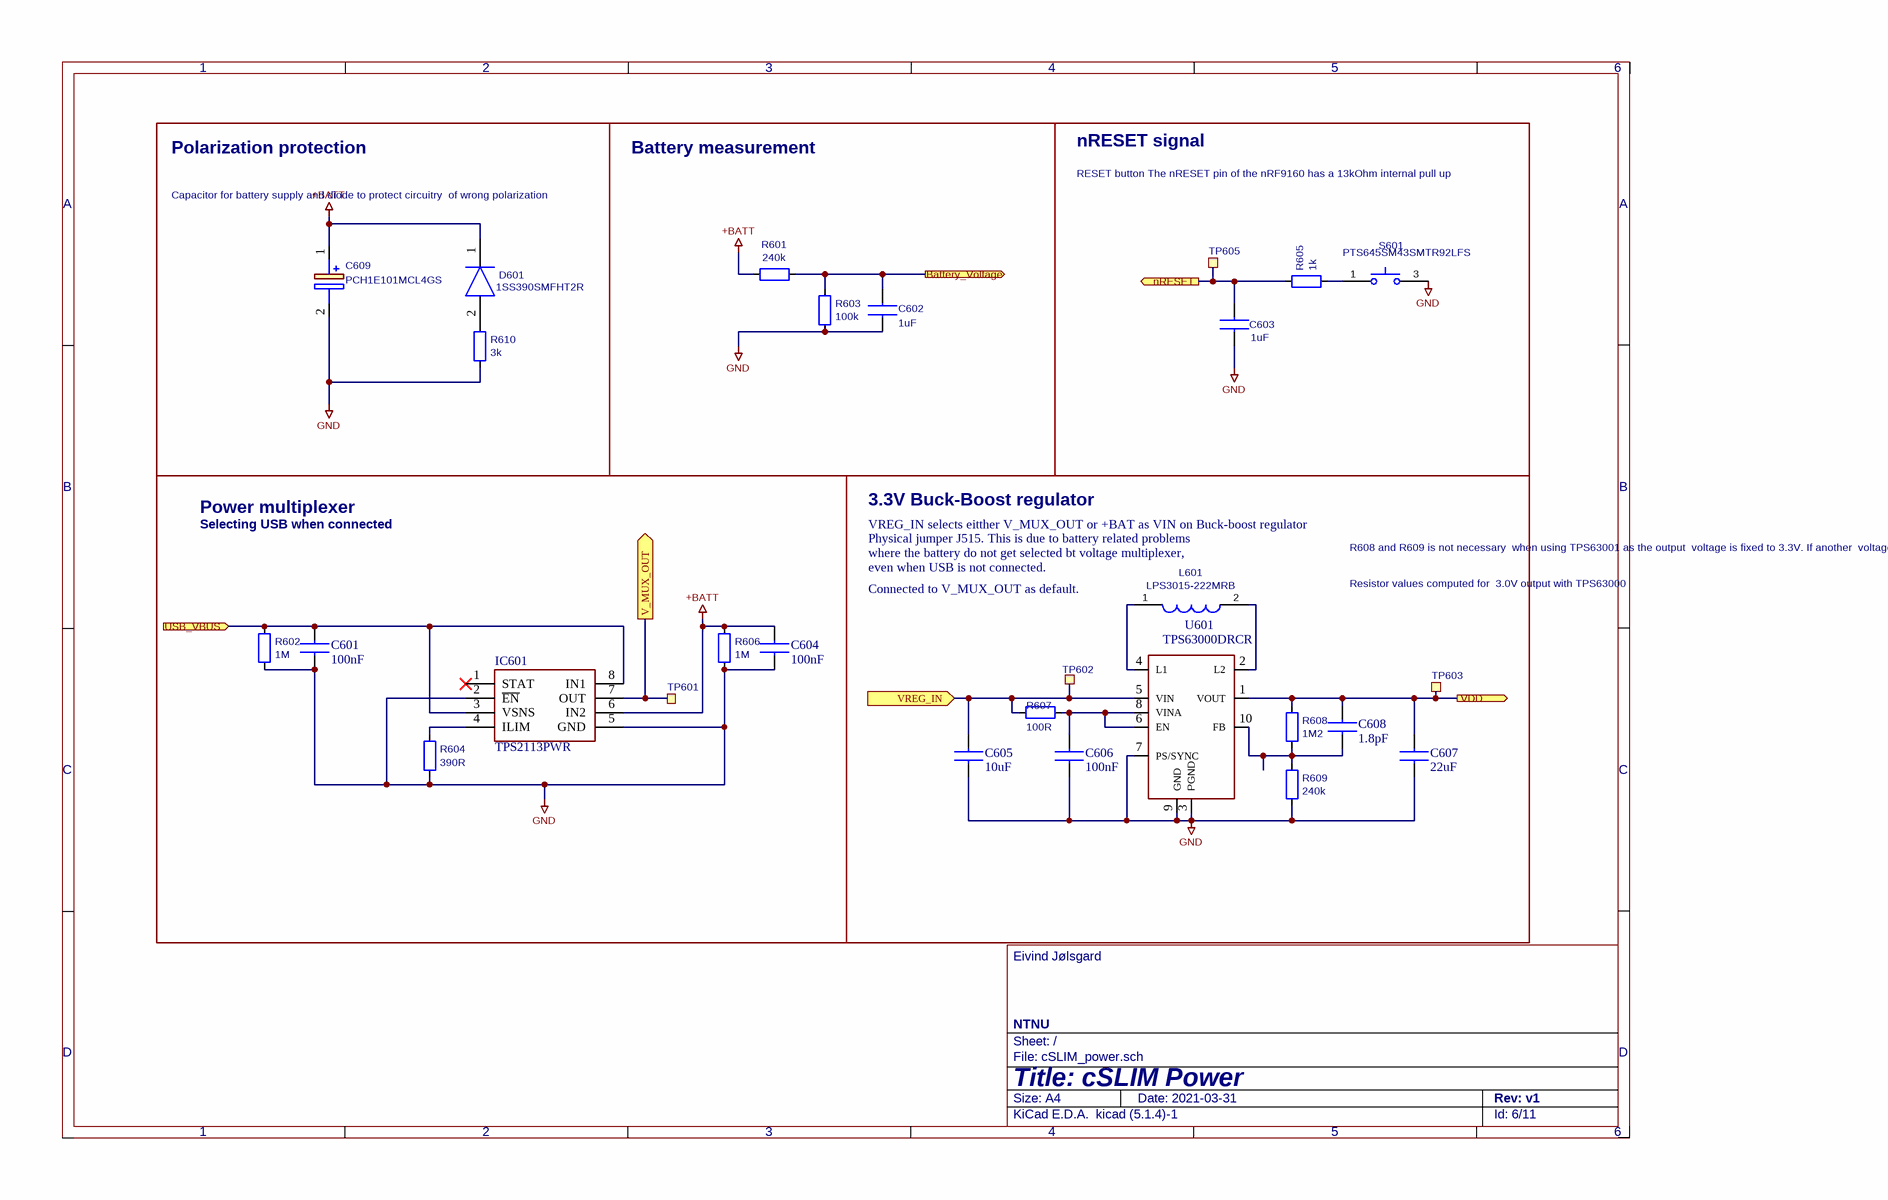
[diagram p5: cSLIM-SA_power.SchDoc]

### Parts
C601  100nF  [CAPC1608X90N]
C602  1uF  [CAPC1608X90N]
C603  1uF  [CAPC1608X90N]
C604  100nF  [CAPC1608X90N]
C605  10uF  [CAPC1608X90N]
C606  100nF  [CAPC1608X90N]
C607  22uF  [CAPC1608X90N]
C608  1.8pF  [CAPC1608X90N]
C609  PCH1E101MCL4GS  [CAPAE660X840N]
D601  1SS390SMFHT2R  [SODFL1608X70N]
IC601  TPS2113PWR  [SOP65P640X120-8N]
L601  LPS3015-222MRB  [LPS3015]
R601  240k  [RESC1608X55N]
R602  1M  [RESC1608X55N]
R603  100k  [RESC1608X55N]
R604  390R  [RESC1608X55N]
R605  1k  [RESC1608X55N]
R606  1M  [RESC1608X55N]
R607  100R  [RESC1608X55N]
R608  1M2  [RESC1608X55N]
R609  240k  [RESC1608X55N]
R610  3k  [RESC1608X55N]
S601  value PTS645SM43SMTR92LFS  [PTS645(SMT)]
TP601  (no value)  [TP_SMD_Ø1.0mm]  (no BOM)
TP602  (no value)  [TP_SMD_Ø1.0mm]  (no BOM)
TP603  (no value)  [TP_SMD_Ø1.0mm]  (no BOM)
TP605  (no value)  [TP_SMD_Ø1.0mm]  (no BOM)
U601  TPS63000DRCR  [TPS63002DRCR]

### Ports
Battery_Voltage (out), nRESET (out), USB_VBUS (in), V_MUX_OUT (out), VDD (out), VREG_IN (in)

### Nets
+BATT: C604.1 C609.1(+) D601.1(K) IC601.6(IN2) R601.2 R606.1
GND: C601.2 C602.2 C603.2 C604.2 C605.2 C606.2 C607.2 C609.2(-) IC601.2(~{EN}) IC601.5(GND) R602.2 R603.2 R604.2 R606.2 R609.2 R610.2 S601.3 U601.3(PGND) U601.7(PS/SYNC) U601.9(GND)
VDD: C607.1 C608.1 R608.1 TP603.1 U601.1(VOUT) ; port VDD
Battery_voltage: C602.1 R601.1 R603.1 ; port Battery_Voltage
nRESET: C603.1 R605.1 TP605.1 ; port nRESET
USB_VBUS: C601.1 IC601.3(VSNS) IC601.8(IN1) R602.1 ; port USB_VBUS
V_MUX_OUT: IC601.7(OUT) TP601.1 ; port V_MUX_OUT
VREG_IN: C605.1 R607.2 TP602.1 U601.5(VIN) ; port VREG_IN
NetC606_1: C606.1 R607.1 U601.6(EN) U601.8(VINA)
NetC608_2: C608.2 R608.2 R609.1 U601.10(FB)
NetD601_2: D601.2(A) R610.1
NetIC601_4: IC601.4(ILIM) R604.1
NetL601_1: L601.1 U601.4(L1)
NetL601_2: L601.2 U601.2(L2)
NetR605_2: R605.2 S601.1

Not connected (* = marked no-connect by the designer): IC601 1(STAT)*

### Notes on the sheet
- Capacitor for battery supply
  and diode to protect circuitry
  of wrong polarization
- Polarization protection
- Battery measurement
- RESET button
  The nRESET pin of the nRF9160 has a 13kOhm internal pull up
- nRESET signal
- 3.3V Buck-Boost regulator
- Selecting USB when connected
- Power multiplexer
- VREG_IN selects eitther V_MUX_OUT or +BAT as VIN on Buck-boost regulator
- Physical jumper J515. This is due to battery related problems
- (near L601) where the battery do not get selected bt voltage multiplexer,
- even when USB is not connected.
- R608 and R609 is not necessary
  when using TPS63001 as the output
  voltage is fixed to 3.3V. If another
  voltage is required use TPS63000
  with appropriate resistor values
- Connected to V_MUX_OUT as default.
- Resistor values computed for
  3.0V output with TPS63000
- 1
- 2
- 3
- 4
- 5
- 6
- A
- B
- C
- Eivind Jølsgard
- D
- Title: cSLIM Power
- File: cSLIM_power.sch
- Sheet: /
- NTNU
- KiCad E.D.A.  kicad (5.1.4)-1
- Size: A4
- Date: 2021-03-31
- Rev: v1
- Id: 6/11

### Library data of the parts
C601-C608 = C: as C301 on sheet cSLIM-SA_RS485; Datasheet Link: http://www.mouser.com/catalog/supplier/library/pdf/AVXSurfaceMountCeramic.pdf; Height: 0.9mm; Mouser Part Number: 581-06033G104Z; Mouser Price/Stock: https://www.mouser.co.uk/ProductDetail/AVX/06033G104ZAT2A?qs=NXubJDmysXJMPmHfVo6Z%252BA%3D%3D; Arrow Part Number: 06033G104ZAT2A; Arrow Price/Stock: https://www.arrow.com/en/products/06033g104zat2a/avx?region=nac
C609 = PCH1E101MCL4GS: Capacitor Polarised; Manufacturer_Name: Nichicon; Datasheet Link: https://componentsearchengine.com/Datasheets/2/PCH1E101MCL4GS.pdf; Height: 8.4mm; Manufacturer_Part_Number: PCH1E101MCL4GS; Mouser Part Number: 647-PCH1E101MCL4GS; Mouser Price/Stock: https://www.mouser.co.uk/ProductDetail/Nichicon/PCH1E101MCL4GS?qs=vmHwEFxEFR%252Bar6ugXaASOA%3D%3D
D601 = 1SS390SMFHT2R: Diode; Manufacturer_Name: ROHM Semiconductor; Height: 0.7mm; Mouser Part Number: 755-1SS390SMFHT2R; Mouser Price/Stock: https://www.mouser.co.uk/ProductDetail/ROHM-Semiconductor/1SS390SMFHT2R?qs=0lSvoLzn4L%2FO2HkvK5CJsQ%3D%3D; Manufacturer_Part_Number: 1SS390SMFHT2R; Datasheet Link: https://componentsearchengine.com/Datasheets/2/1SS390SMFHT2R.pdf
IC601 = TPS2113PWR: Integrated Circuit; Manufacturer_Name: Texas Instruments; Datasheet Link: http://www.ti.com/lit/ds/symlink/tps2113.pdf; Height: 1.2mm; Manufacturer_Part_Number: TPS2113PWR; Mouser Part Number: 595-TPS2113PWR; Mouser Price/Stock: https://www.mouser.co.uk/ProductDetail/Texas-Instruments/TPS2113PWR?qs=ojKcPFmCWSUJzuMPtPVtlA%3D%3D; Arrow Part Number: TPS2113PWR; Arrow Price/Stock: https://www.arrow.com/en/products/tps2113pwr/texas-instruments
L601 = LPS3015-103MRB: Manufacturer_Name: COILCRAFT; Mouser Part Number: 994-LPS3015-103MRB; Mouser Price/Stock: https://www.mouser.co.uk/ProductDetail/Coilcraft/LPS3015-103MRB?qs=QQJxVsr8EGaKHQsQv461ew%3D%3D; Manufacturer_Part_Number: LPS3015-103MRB; Value: LPS3015-222MRB; Footprint: SamacSys:LPS3015
R601-R610 = R
  R601 R609: Value: 240k
  R602 R606: Value: 1M
  R603: Value: 100k
  R604: Value: 390R
  R605: Value: 1k
  R607: Value: 100R
  R608: Value: 1M2
  R610: Value: 3k
S601 = PTS645SM43SMTR92LFS: Switch 4-pi. used 1-3 (2-4 not in use); Manufacturer_Name: C & K COMPONENTS; Manufacturer_Part_Number: TLS A 070J LFS; Description_: Tactile Switches Top actuated tact, 0.9 mm travel, 7 N, 50% Tactile, J Leads, SMT, 8.6 x 8.4 x 3.95 mm, Soft Actuator; Footprint: TLSA070JLFS; Supplier: https://www.mouser.ph/datasheet/2/60/tls-1846606.pdf; Mouser Part Number: 611-TLSA070JLFS; Mouser Price/Stock: https://www.mouser.co.uk/ProductDetail/CK/TLS-A-070J-LFS?qs=GedFDFLaBXEdAqJ422mDcw%3D%3D
TP601-TP603 TP605 = TP
U601 = TPS63000DRCR: Integrated Circuit; Manufacturer_Name: Texas Instruments; Datasheet Link: https://www.ti.com/lit/ds/symlink/tps63000.pdf?HQS=ti-null-null-sf-df-pf-sep-wwe&ts=1593405994673; Height: 1mm; Manufacturer_Part_Number: TPS63000DRCR; Mouser Part Number: 595-TPS63000DRCR; Mouser Price/Stock: https://www.mouser.co.uk/ProductDetail/Texas-Instruments/TPS63000DRCR?qs=QZuYiDxzHaj%2FxB6t44u%252B6Q%3D%3D; Arrow Part Number: TPS63000DRCR; Arrow Price/Stock: https://www.arrow.com/en/products/tps63000drcr/texas-instruments?region=nac

## Sheet cSLIM-SA_uSD.SchDoc: cSLIM v1 - uSD
size A4; SheetNumber: 8; SheetTotal: 12
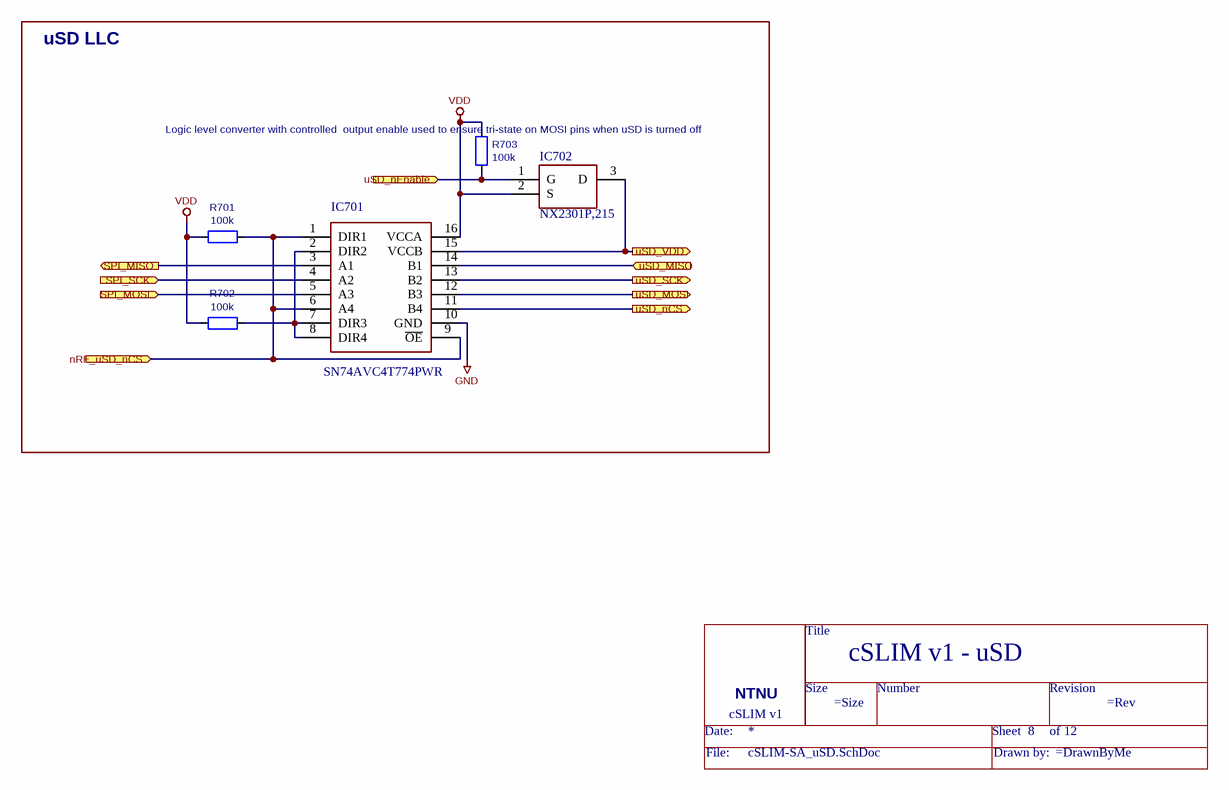
[diagram p6: cSLIM-SA_uSD.SchDoc]

### Parts
(Parts that share a designator on the sheet are numbered #1, #2 ... from top to bottom, then left to right.)
=DocumentName#2  Title_block  (value not drawn)  (no BOM)
IC701  SN74AVC4T774PWR  [SOP65P640X120-16N]
IC702  NX2301P,215  [SOT95P230X110-3N]
R701  100k  [RESC1608X55N]
R702  100k  [RESC1608X55N]
R703  100k  [RESC1608X55N]

### Blocks framed on the sheet
uSD LLC: IC701 IC702 R701-R703

### Ports
nRF_uSD_nCS (in), SPI_MISO (out), SPI_MOSI (in), SPI_SCK (in), uSD_MISO (in), uSD_MOSI (out), uSD_nCS (out), uSD_nEnable (in), uSD_SCK (out), uSD_VDD (out)

### Nets
GND: IC701.10(GND)
VDD: IC701.16(VCCA) IC702.2(S) R701.2 R702.2 R703.2
nRF_uSD_nCS: IC701.1(DIR1) IC701.6(A4) IC701.9(~{OE}) R701.1 ; port nRF_uSD_nCS
SPI_MISO: IC701.3(A1) ; port SPI_MISO
SPI_MOSI: IC701.5(A3) ; port SPI_MOSI
SPI_SCK: IC701.4(A2) ; port SPI_SCK
uSD_MISO: IC701.14(B1) ; port uSD_MISO
uSD_MOSI: IC701.12(B3) ; port uSD_MOSI
uSD_nCS: IC701.11(B4) ; port uSD_nCS
uSD_nEnable: IC702.1(G) R703.1 ; port uSD_nEnable
uSD_SCK: IC701.13(B2) ; port uSD_SCK
uSD_VDD: IC701.15(VCCB) IC702.3(D) ; port uSD_VDD
NetIC701_2: IC701.2(DIR2) IC701.7(DIR3) IC701.8(DIR4) R702.1

### Notes on the sheet
- (near R703) Logic level converter with controlled
  output enable used to ensure tri-state
  on MOSI pins when uSD is turned off
- 1
- 2
- 3
- 4
- 5
- 6
- A
- B
- C
- Eivind Jølsgard
- D
- Title: cSLIM uSD
- File: cSLIM_uSD.sch
- Sheet: /
- NTNU
- KiCad E.D.A.  kicad (5.1.4)-1
- Size: A4
- Date: 2021-03-31
- Rev: v1
- Id: 7/11
- (in symbol Title_block) Title; Size; Number; Revision; NTNU; cSLIM v1; Date:; Sheet; of; File:; Drawn by:

### Library data of the parts
IC701 = SN74AVC4T774PWR: as IC202 on sheet cSLIM-SA-LoRa; Datasheet Link: http://www.ti.com/lit/gpn/sn74avc4t774; Height: 1.2mm; Manufacturer_Part_Number: SN74AVC4T774PWR; Mouser Part Number: 595-SN74AVC4T774PWR; Mouser Price/Stock: https://www.mouser.co.uk/ProductDetail/Texas-Instruments/SN74AVC4T774PWR?qs=WxL8HmPi5r562Eu%2F2kE2LA%3D%3D; Arrow Part Number: SN74AVC4T774PWR; Arrow Price/Stock: https://www.arrow.com/en/products/sn74avc4t774pwr/texas-instruments?region=nac
IC702 = NX2301P,215: as IC203 on sheet cSLIM-SA-LoRa; Datasheet Link: http://www.nxp.com/documents/data_sheet/NX2301P.pdf; Height: 1.1mm; Manufacturer_Part_Number: NX2301P,215; Mouser Part Number: 771-NX2301P215; Mouser Price/Stock: https://www.mouser.co.uk/ProductDetail/Nexperia/NX2301P215?qs=A1cBxND5mHKs%252BLrxCDENxw%3D%3D; Arrow Part Number: NX2301P,215; Arrow Price/Stock: https://www.arrow.com/en/products/nx2301p215/nexperia
R701-R703 = R: Value: 100k

## Sheet cSLIM-SA_display.SchDoc
size 297 x 210 mm; SheetNumber: 9
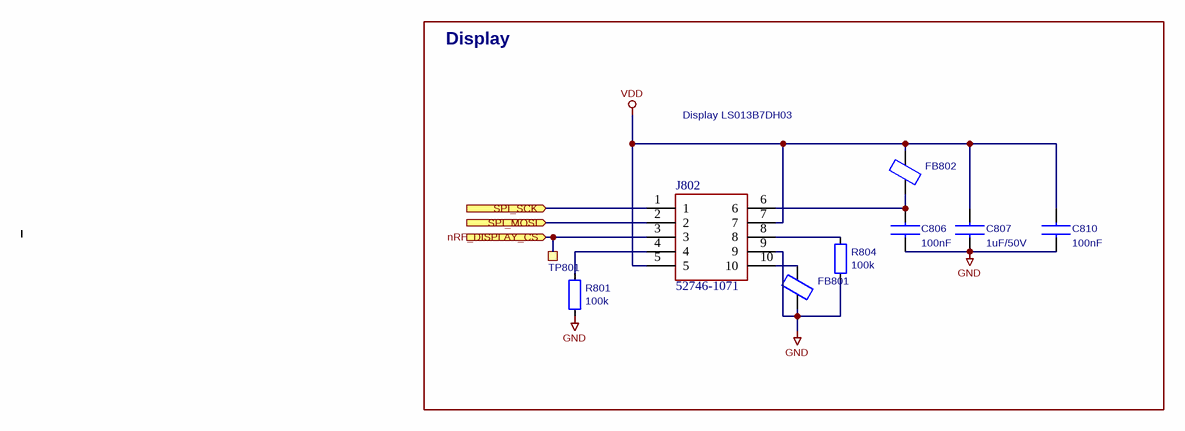
[diagram p7: cSLIM-SA_display.SchDoc]

### Parts
C806  100nF  [CAPC1608X90N]
C807  1uF/50V  [CAPC1608X90N]
C810  100nF  [CAPC1608X90N]
FB801  Ferrite_Bead  [CAPC1608X90N]  (value not drawn)
FB802  Ferrite_Bead  [CAPC1608X90N]  (value not drawn)
J802  52746-1071  [52746-1071]
R801  100k  [RESC1608X55N]
R804  100k  [RESC1608X55N]
TP801  (no value)  [TP_SMD_Ø1.0mm]  (no BOM)

### Ports
nRF_DISPLAY_CS (in), SPI_MOSI (in), SPI_SCK (in)

### Nets
GND: C806.2 C807.2 C810.2 FB801.2 J802.9 R801.2 R804.2
VDD: C807.1 C810.1 FB802.1 J802.5 J802.7
nRF_DISPLAY_CS: J802.3 TP801.1 ; port nRF_DISPLAY_CS
SPI_MOSI: J802.2 ; port SPI_MOSI
SPI_SCK: J802.1 ; port SPI_SCK
NetC806_1: C806.1 FB802.2 J802.6
NetFB801_1: FB801.1 J802.10
NetJ802_4: J802.4 R801.1
NetJ802_8: J802.8 R804.1

### Notes on the sheet
- Display
- Display
  LS013B7DH03
- 1
- 2
- 3
- 4
- 5
- 6
- A
- B
- C
- Eivind Jølsgard
- D
- Title: cSLIM Display
- File: cSLIM_display.sch
- Sheet: /
- NTNU
- KiCad E.D.A.  kicad (5.1.4)-1
- Size: A4
- Date: 2021-06-30
- Rev: v1.1
- Id: 8/11

### Library data of the parts
C806 C807 C810 = C: as C301 on sheet cSLIM-SA_RS485; Datasheet Link: http://www.mouser.com/catalog/supplier/library/pdf/AVXSurfaceMountCeramic.pdf; Height: 0.9mm; Mouser Part Number: 581-06033G104Z; Mouser Price/Stock: https://www.mouser.co.uk/ProductDetail/AVX/06033G104ZAT2A?qs=NXubJDmysXJMPmHfVo6Z%252BA%3D%3D; Arrow Part Number: 06033G104ZAT2A; Arrow Price/Stock: https://www.arrow.com/en/products/06033g104zat2a/avx?region=nac
J802 = 52746-1071: Connector; Manufacturer_Name: Molex; Datasheet Link: http://www.molex.com/pdm_docs/sd/527461071_sd.pdf; Manufacturer_Part_Number: 52746-1071; Mouser Part Number: 538-52746-1071; Mouser Price/Stock: https://www.mouser.co.uk/ProductDetail/Molex/52746-1071?qs=gi08C7HaimYPHJccIEZoxg%3D%3D
R801 R804 = R: Value: 100k
TP801 = TP